# Altium project MC21R01.PrjPCB (part 2 of 3)

## Sheet MC21R01_Inverter_2.SchDoc: MC21R01 Top Level
size A3; Author: AMP; DrawnBy: AMP; Organization: Altium Limited; Address1: 3 Minna Close; Address2: Belrose; Address3: NSW 2085; Address4: Australia; DocumentNumber: 0; Revision: 1.0; SheetNumber: 0; SheetTotal: 0
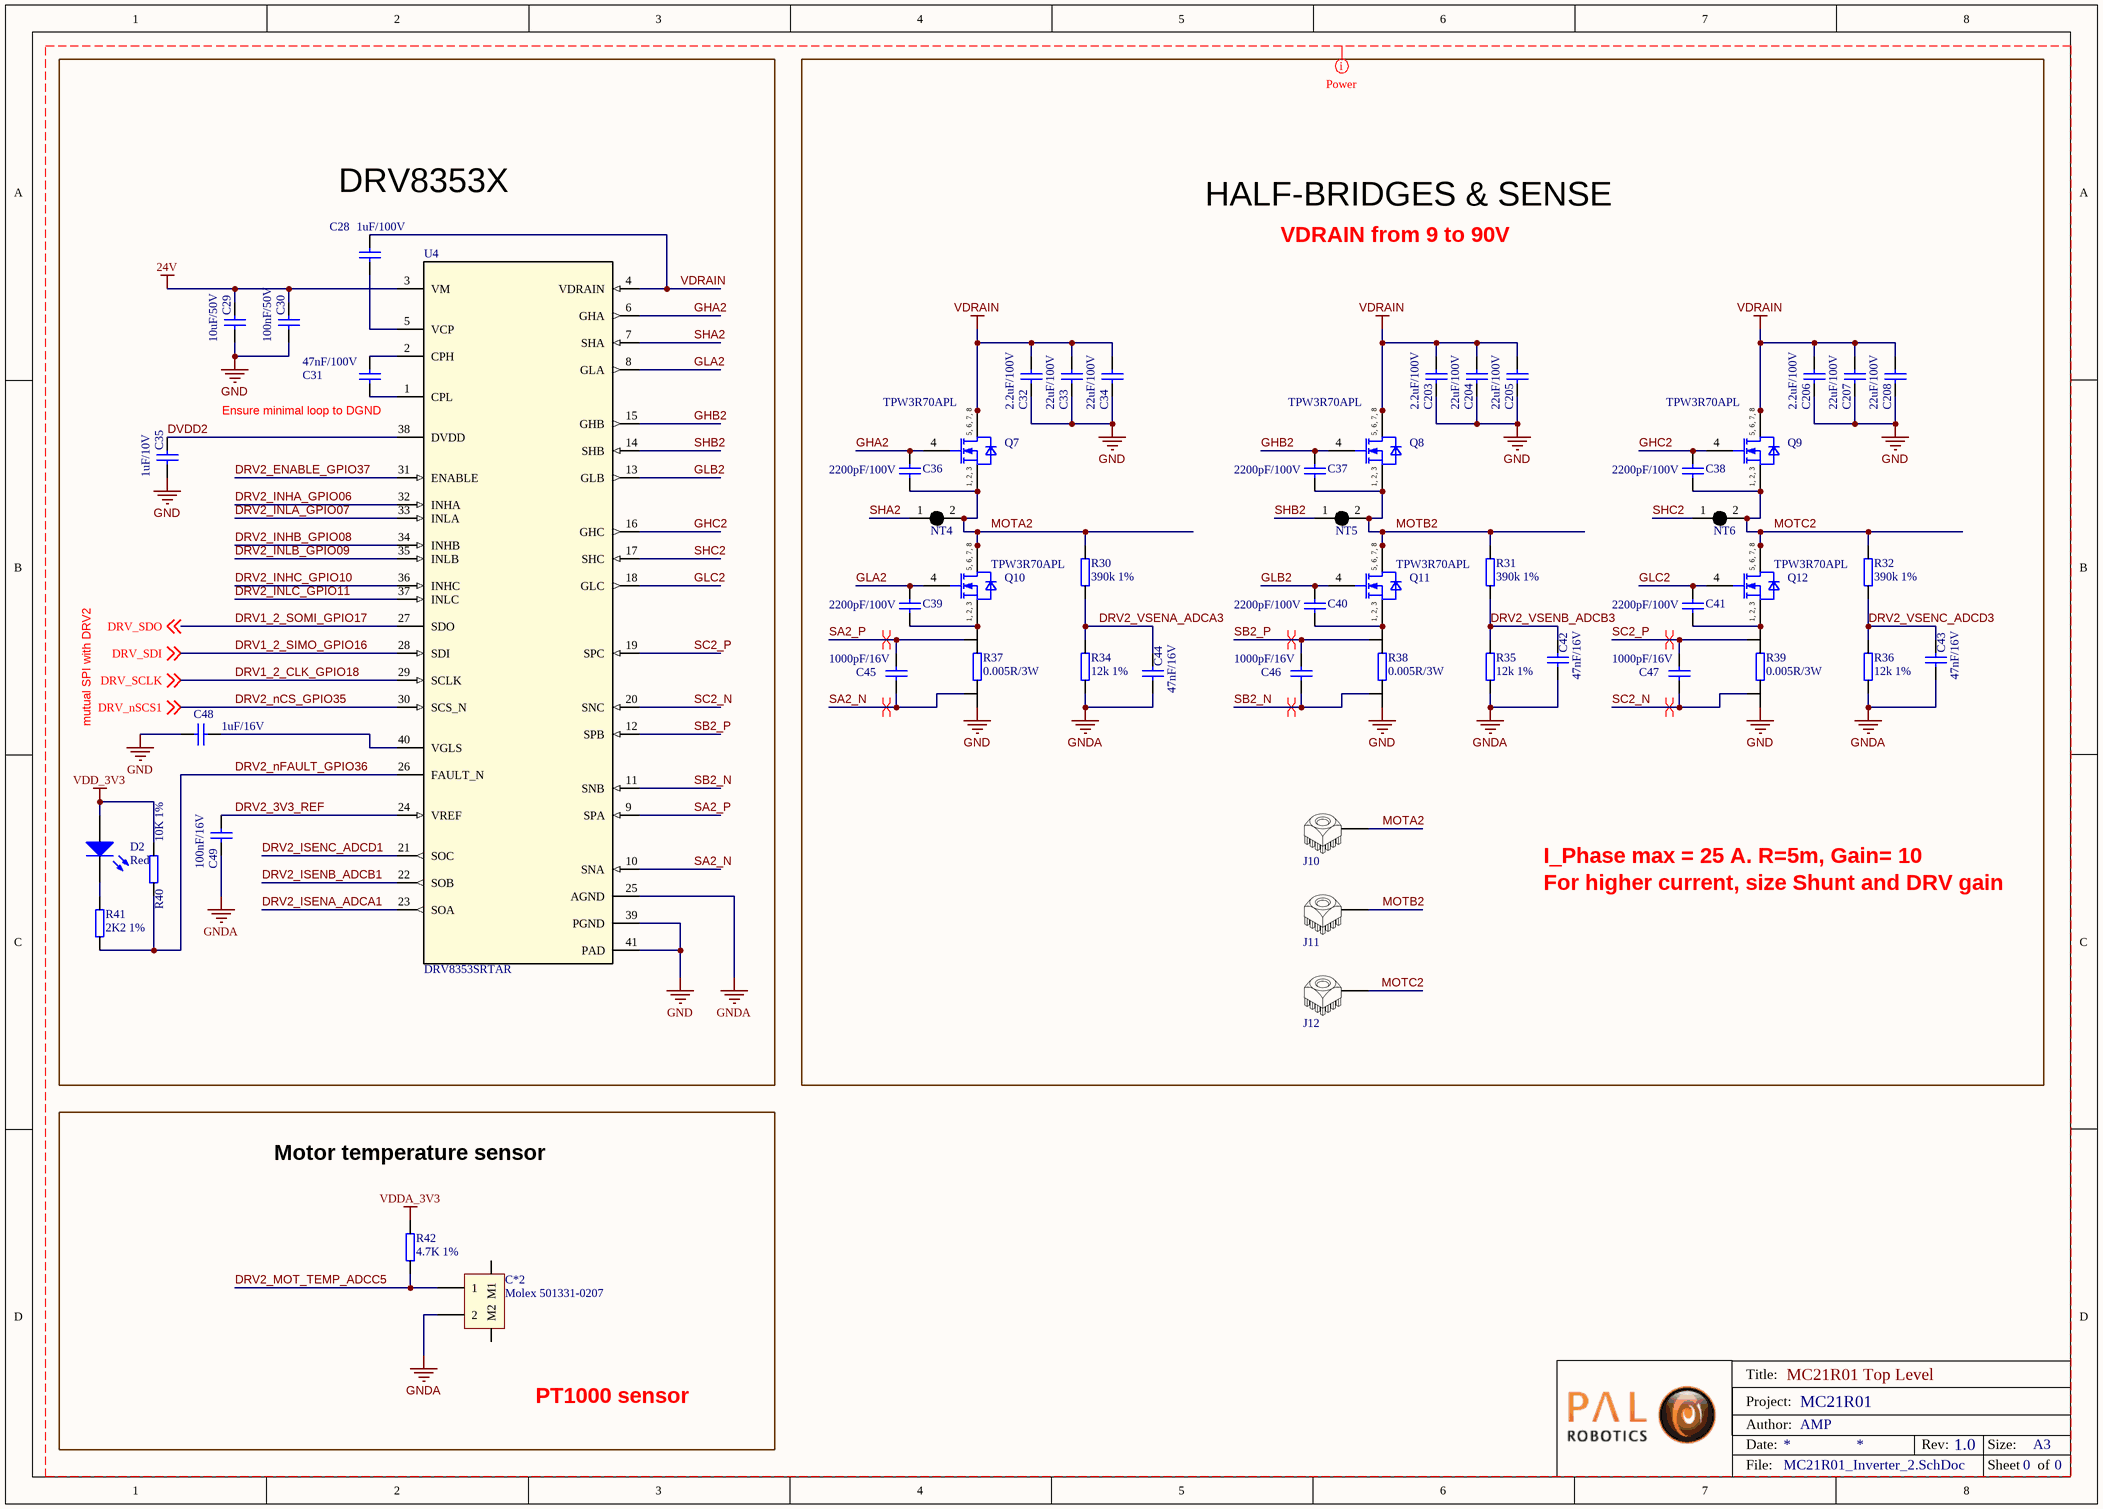
[diagram p6: MC21R01_Inverter_2.SchDoc]

### Parts
C28  value 1uF/100V  [0805 SMD capacitor]  (hidden comment: 1uF/100V 0805 10% X7R)
C29  value 10uF/50V  [1206 SMD Capacitor]  (hidden comment: 10uf/50V 1206 20% X5R)
C30  value 100nF/50V  [0603 SMD capacitor]  (hidden comment: 100nF/50V 0603 10% X7R)
C31  value 47nF/100V  [0603 SMD capacitor]  (hidden comment: 47nF/100V 0603 10% X7R)
C32  value 2.2uF/100V  [1210 SMD capacitor h=2mm]  (hidden comment: 2.2uF/100V 1210 10% X7R)
C33  value 22uF/100V  [2220 SMD Capacitor H=5MM]  (hidden comment: 22uF/100V 2220 20% X7S)
C34  value 22uF/100V  [2220 SMD Capacitor H=5MM]  (hidden comment: 22uF/100V 2220 20% X7S)
C35  value 1uF/10V  [0603 SMD capacitor]  (hidden comment: 1uF/10V 0603 10% X7R)
C36  value 2200pF/100V  [0402 SMD Capacitor]  (hidden comment: 2200pF/100V 0402 10% X7S)
C37  value 2200pF/100V  [0402 SMD Capacitor]  (hidden comment: 2200pF/100V 0402 10% X7S)
C38  value 2200pF/100V  [0402 SMD Capacitor]  (hidden comment: 2200pF/100V 0402 10% X7S)
C39  value 2200pF/100V  [0402 SMD Capacitor]  (hidden comment: 2200pF/100V 0402 10% X7S)
C40  value 2200pF/100V  [0402 SMD Capacitor]  (hidden comment: 2200pF/100V 0402 10% X7S)
C41  value 2200pF/100V  [0402 SMD Capacitor]  (hidden comment: 2200pF/100V 0402 10% X7S)
C42  value 47nF/16V  [0402 SMD Capacitor]  (hidden comment: 47nF/16V 0402 10% X7R)
C43  value 47nF/16V  [0402 SMD Capacitor]  (hidden comment: 47nF/16V 0402 10% X7R)
C44  value 47nF/16V  [0402 SMD Capacitor]  (hidden comment: 47nF/16V 0402 10% X7R)
C45  value 1000pF/16V  [0402 SMD Capacitor]  (hidden comment: 1000pF/16V 0402 10% X7R)
C46  value 1000pF/16V  [0402 SMD Capacitor]  (hidden comment: 1000pF/16V 0402 10% X7R)
C47  value 1000pF/16V  [0402 SMD Capacitor]  (hidden comment: 1000pF/16V 0402 10% X7R)
C48  value 1uF/16V  [0603 SMD capacitor]  (hidden comment: 1uF/16V 0603 10% X7R)
C49  value 100nF/16V  [0402 SMD Capacitor]  (hidden comment: 100nF/16V 0402 10% X7R)
C203  value 2.2uF/100V  [1210 SMD capacitor h=2mm]  (hidden comment: 2.2uF/100V 1210 10% X7R)
C204  value 22uF/100V  [2220 SMD Capacitor H=5MM]  (hidden comment: 22uF/100V 2220 20% X7S)
C205  value 22uF/100V  [2220 SMD Capacitor H=5MM]  (hidden comment: 22uF/100V 2220 20% X7S)
C206  value 2.2uF/100V  [1210 SMD capacitor h=2mm]  (hidden comment: 2.2uF/100V 1210 10% X7R)
C207  value 22uF/100V  [2220 SMD Capacitor H=5MM]  (hidden comment: 22uF/100V 2220 20% X7S)
C208  value 22uF/100V  [2220 SMD Capacitor H=5MM]  (hidden comment: 22uF/100V 2220 20% X7S)
C*2  Molex 501331-0207  [Molex 501331-0207]
D2  Red  [0402 SMD LED Red]
J10  WE_7461094  [WE_7461094]  (value not drawn)
J11  WE_7461094  [WE_7461094]  (value not drawn)
J12  WE_7461094  [WE_7461094]  (value not drawn)
NT4  Net Tie SMD  [Net Tie SMD 0.4x0.8mm]  (value not drawn)  (net tie, no BOM)
NT5  Net Tie SMD  [Net Tie SMD 0.4x0.8mm]  (value not drawn)  (net tie, no BOM)
NT6  Net Tie SMD  [Net Tie SMD 0.4x0.8mm]  (value not drawn)  (net tie, no BOM)
Q7  TPW3R70APL  [DSOP Advance Toshiba]
Q8  TPW3R70APL  [DSOP Advance Toshiba]
Q9  TPW3R70APL  [DSOP Advance Toshiba]
Q10  TPW3R70APL  [DSOP Advance Toshiba]
Q11  TPW3R70APL  [DSOP Advance Toshiba]
Q12  TPW3R70APL  [DSOP Advance Toshiba]
R30  390k 1%  [0603 SMD resistor]
R31  390k 1%  [0603 SMD resistor]
R32  390k 1%  [0603 SMD resistor]
R34  12k 1%  [0603 SMD resistor]
R35  12k 1%  [0603 SMD resistor]
R36  12k 1%  [0603 SMD resistor]
R37  0.005R/3W  [2512 SMD Resistor V2 NETTIE]
R38  0.005R/3W  [2512 SMD Resistor V2 NETTIE]
R39  0.005R/3W  [2512 SMD Resistor V2 NETTIE]
R40  10K 1%  [0402 SMD rESISTOR]
R41  2K2 1%  [0402 SMD rESISTOR]
R42  4.7K 1%  [0402 SMD rESISTOR]
U4  DRV8353SRTAR  [QFN50P600X600X80_HS-41N]

### Blocks framed on the sheet
DRV8353X: C28-C31 C35 C48 C49 D2 R40 R41 U4
HALF-BRIDGES & SENSE: C32-C34 C36-C47 C203-C208 J10-J12 NT4-NT6 Q7-Q12 R30-R32 R34-R39

### Nets
24V: C29.1 C30.1 U4.3(VM)
GND: C29.2 C30.2 C32.2 C33.2 C34.2 C35.2 C48.1 C203.2 C204.2 C205.2 C206.2 C207.2 C208.2 R37.1 R38.1 R39.1 U4.39(PGND) U4.41(PAD)
GNDA: C42.2 C43.2 C44.2 C49.2 C*2.2 R34.1 R35.1 R36.1 U4.25(AGND)
VDD_3V3: D2.A R40.2
VDDA_3V3: R42.2
VDRAIN: C28.1 C32.1 C33.1 C34.1 C203.1 C204.1 C205.1 C206.1 C207.1 C208.1 Q7.5(DRAIN) Q7.6(DRAIN) Q7.7(DRAIN) Q7.8(DRAIN) Q8.5(DRAIN) Q8.6(DRAIN) Q8.7(DRAIN) Q8.8(DRAIN) Q9.5(DRAIN) Q9.6(DRAIN) Q9.7(DRAIN) Q9.8(DRAIN) U4.4(VDRAIN)
DRV1_2_CLK_GPIO18: U4.29(SCLK) ; off-sheet DRV_SCLK  [also labelled DRV_SCLK]
DRV1_2_SIMO_GPIO16: U4.28(SDI) ; off-sheet DRV_SDI  [also labelled DRV_SDI]
DRV1_2_SOMI_GPIO17: U4.27(SDO) ; off-sheet DRV_SDO  [also labelled DRV_SDO]
DRV2_3V3_REF: C49.1 U4.24(VREF)
DRV2_ENABLE_GPIO37: U4.31(ENABLE)
DRV2_INHA_GPIO06: U4.32(INHA)
DRV2_INHB_GPIO08: U4.34(INHB)
DRV2_INHC_GPIO10: U4.36(INHC)
DRV2_INLA_GPIO07: U4.33(INLA)
DRV2_INLB_GPIO09: U4.35(INLB)
DRV2_INLC_GPIO11: U4.37(INLC)
DRV2_ISENA_ADCA1: U4.23(SOA)
DRV2_ISENB_ADCB1: U4.22(SOB)
DRV2_ISENC_ADCD1: U4.21(SOC)
DRV2_MOT_TEMP_ADCC5: C*2.1 R42.1
DRV2_nCS_GPIO35: U4.30(SCS_N) ; off-sheet DRV_nSCS1  [also labelled DRV_nSCS1]
DRV2_nFAULT_GPIO36: R40.1 R41.1 U4.26(FAULT_N)
DRV2_VSENA_ADCA3: C44.1 R30.1 R34.2
DRV2_VSENB_ADCB3: C42.1 R31.1 R35.2
DRV2_VSENC_ADCD3: C43.1 R32.1 R36.2
DVDD2: C35.1 U4.38(DVDD)
GHA2: C36.1 Q7.4(GATE) U4.6(GHA)
GHB2: C37.1 Q8.4(GATE) U4.15(GHB)
GHC2: C38.1 Q9.4(GATE) U4.16(GHC)
GLA2: C39.1 Q10.4(GATE) U4.8(GLA)
GLB2: C40.1 Q11.4(GATE) U4.13(GLB)
GLC2: C41.1 Q12.4(GATE) U4.18(GLC)
MOTA2: C36.2 J10.1 NT4.2 Q7.1(SOURCE) Q7.2(SOURCE) Q7.3(SOURCE) Q10.5(DRAIN) Q10.6(DRAIN) Q10.7(DRAIN) Q10.8(DRAIN) R30.2
MOTB2: C37.2 J11.1 NT5.2 Q8.1(SOURCE) Q8.2(SOURCE) Q8.3(SOURCE) Q11.5(DRAIN) Q11.6(DRAIN) Q11.7(DRAIN) Q11.8(DRAIN) R31.2
MOTC2: C38.2 J12.1 NT6.2 Q9.1(SOURCE) Q9.2(SOURCE) Q9.3(SOURCE) Q12.5(DRAIN) Q12.6(DRAIN) Q12.7(DRAIN) Q12.8(DRAIN) R32.2
SA2_N: C45.2 R37.3 U4.10(SNA)
SA2_P: C45.1 R37.4 U4.9(SPA)
SB2_N: C46.2 R38.3 U4.11(SNB)
SB2_P: C46.1 R38.4 U4.12(SPB)
SC2_N: C47.2 R39.3 U4.20(SNC)
SC2_P: C47.1 R39.4 U4.19(SPC)
SHA2: NT4.1 U4.7(SHA)
SHB2: NT5.1 U4.14(SHB)
SHC2: NT6.1 U4.17(SHC)
NetC28_2: C28.2 U4.5(VCP)
NetC31_1: C31.1 U4.2(CPH)
NetC31_2: C31.2 U4.1(CPL)
NetC39_2: C39.2 Q10.1(SOURCE) Q10.2(SOURCE) Q10.3(SOURCE) R37.2
NetC40_2: C40.2 Q11.1(SOURCE) Q11.2(SOURCE) Q11.3(SOURCE) R38.2
NetC41_2: C41.2 Q12.1(SOURCE) Q12.2(SOURCE) Q12.3(SOURCE) R39.2
NetC48_2: C48.2 U4.40(VGLS)
NetD2_K: D2.K R41.2

Not connected (* = marked no-connect by the designer): C*2 M1 M2

### Layout directives
net class Power: 24V, DRV1_2_CLK_GPIO18, DRV1_2_SIMO_GPIO16, DRV1_2_SOMI_GPIO17, DRV2_3V3_REF, DRV2_ENABLE_GPIO37, DRV2_INHA_GPIO06, DRV2_INHB_GPIO08, DRV2_INHC_GPIO10, DRV2_INLA_GPIO07, DRV2_INLB_GPIO09, DRV2_INLC_GPIO11, DRV2_ISENA_ADCA1, DRV2_ISENB_ADCB1, DRV2_ISENC_ADCD1, DRV2_MOT_TEMP_ADCC5, DRV2_nCS_GPIO35, DRV2_nFAULT_GPIO36, DRV2_VSENA_ADCA3, DRV2_VSENB_ADCB3, DRV2_VSENC_ADCD3, DRV_nSCS1, DRV_SCLK, DRV_SDI, DRV_SDO, DVDD2, GHA2, GHB2, GHC2, GLA2, GLB2, GLC2, GND, GNDA, MOTA2, MOTB2, MOTC2, SA2_N, SA2_P, SB2_N, SB2_P, SC2_N, SC2_P, SHA2, SHB2, SHC2, VDD_3V3, VDDA_3V3, VDRAIN
differential pair; differential pair class ADC: SA2_N, SA2_P, SB2_N, SB2_P, SC2_N, SC2_P

### Notes on the sheet
- VDRAIN from 9 to 90V
- (near C31) Ensure minimal loop to DGND
- mutual SPI with DRV2
- I_Phase max = 25 A. R=5m, Gain= 10
- For higher current, size Shunt and DRV gain
- Motor temperature sensor
- PT1000 sensor
- Title:
- Date:
- Project:
- Author:
- Rev:
- Size:
- A3
- File:
- Sheet
- of
- (in symbol TPW3R70APL) 5, 6, 7, 8; 1, 2, 3

### Library data of the parts
C28 = 1uF/100V 0805 10% X7R: 1 uF 100 V 0805  ±10% Tolerance X7R Multilayer Ceramic Chip Capacitor; Manufacturer 1: AVX; Manufacturer Part Number 1: 08051C105K4T2A; Supplier 1: Farnell; Supplier 2: Mouser; Supplier Part Number 1: 2834935; Supplier Part Number 2: 581-08051C105K4T2A
C29 = 10uF/50V 1206 20% X5R: 10 uF 50 V 1206 ±20% Tolerance X5R Multilayer Ceramic Chip Capacitor; Manufacturer 1: Samsung; Manufacturer Part Number 1: CL31A106MBHNNNE; Supplier 1: Digi-key; Supplier Part Number 1: 1276-6736-1-ND
C30 = 100nF/50V 0603 10% X7R: 100 nF 50 V 0603  ±10% Tolerance X7R Multilayer Ceramic Chip Capacitor; Manufacturer 1: Samsung; Manufacturer Part Number 1: CL10B104KB8NNNC; Supplier Part Number 1: 1276-1000-1-ND; Supplier 1: Digi-key
C31 = 47nF/100V 0603 10% X7R_1: 47 nF 100 V 0603 ±10% Tolerance X7R Multilayer Ceramic Chip Capacitor; Manufacturer 1: KEMET; Manufacturer Part Number 1: C0603C473K1RACTU; Supplier 1: Farnell; Supplier Part Number 1: 1865550
C32 C203 C206 = 2.2uF/100V 1210 10% X7R: 2.2 uF 100 V 1210  ±10% Tolerance X7R Multilayer Ceramic Chip Capacitor; Manufacturer 1: KEMET; Manufacturer Part Number 1: C1210C225K1RACTU; Supplier 1: Farnell; Supplier Part Number 1: 1793832
C33 C34 C204 C205 C207 C208 = 22uF/100V 2220 20% X7S: 22 uF 100 V 2220 ±20% Tolerance X7S Multilayer Ceramic Chip Capacitor; Manufacturer 1: TDK; Manufacturer Part Number 1: CKG57NX7S2A226M500JH; Supplier 1: Farnell; Supplier Part Number 1: 2210742
C35 = 1uF/10V 0603 10% X7R: 1uF/10V 0603 10% Tolerance X7R Multilayer Ceramic Chip Capacitor; Manufacturer 1: TAIYO YUDEN; Manufacturer Part Number 1: LMK107B7105KA-T; Supplier Part Number 1: 2112849; Supplier 1: Farnell
C36-C41 = 2200pF/100V 0402 10% X7S: as C13 on sheet MC21R01_Inverter_1; Supplier 1: Farnell; Supplier Part Number 1: 2906779
C42-C44 = 47nF/16V 0402 10% X7R: 47nF/16V 0402 10% Tolerance X7R Multilayer Ceramic Chip Capacitor; Manufacturer 1: Walsin; Manufacturer Part Number 1: 0402B473J160CT; Supplier 1: Farnell; Supplier Part Number 1: 2524710
C45-C47 = 1000pF/16V 0402 10% X7R_1: 1000pF/16V 0402 10% Tolerance X7R Multilayer Ceramic Chip Capacitor; Manufacturer 1: KEMET; Manufacturer Part Number 1: C0402C102K4RACTU; Supplier 1: Farnell; Supplier Part Number 1: 2522378
C48 = 1uF/16V 0603 10% X7R: 1uF/16V 0603 10% Tolerance X7R Multilayer Ceramic Chip Capacitor; Manufacturer 1: TAIYO YUDEN; Manufacturer Part Number 1: EMK107B7105KA-T; Supplier Part Number 1: 2112839; Supplier 1: Farnell
C49 = 100nF/16V 0402 10% X7R: as C1 on sheet MC21R01_uC_Support; Supplier Part Number 1: 3013350; Supplier 1: Farnell
C*2 = Molex 501331-0207: PicoClasp 02 pin vertical; Supplier 1: Farnell; Supplier Part Number 1: 1835976
D2 = LED_0402_Red: as D1 on sheet MC21R01_Inverter_1; Supplier 1: Farnell; Supplier Part Number 1: 2507545
J10-J12 = WE_7461094: REDCUBE PRESS-FIT with external thread and full plain pin-plate WPSHFU, 130A, M3 screw, 9pins; Manufacturer: WURTH ELEKTRONIK; Manufacturer Part Number: 7461094; Created by: Yaiza Montes; Published: 29/05/20; Value: WE_7461094; Supplier 1: Farnell; Supplier 2: Mouser; Supplier 3: Digi-Key; Supplier Part Number 1: 1821284; Supplier Part Number 2: 710-7461094; Supplier Part Number 3: 732-3212-ND
NT4-NT6 = Net Tie SMD: Net Tie starpoint
Q7-Q12 = TPW3R70APL: Silicon N-channel MOS (U-MOS-H); Manufacturer: Toshiba Semicon; Manufacturer Order Number: TPW3R70APL; PackageReference: DSOP Advance; Supplier 1: Mouser; Supplier 2: Mouser; Supplier Part Number 1: 757-TPW3R70APLL1Q; Supplier Part Number 2: 757-TPW3R70APLL1Q
R30-R32 = 390k/150V 1% 0603 250mW: 390k/150V 1% 0603 250mW SMD Resistor; Manufacturer 1: Panasonic; Manufacturer Part Number 1: ERJPA3F3903V; Supplier 1: Farnell; Supplier Part Number 1: 2335911
R34-R36 = 12k/150V 1% 0603 250mW: 12k/150V 1% 0603 250mW SMD Resistor; Manufacturer 1: Panasonic; Manufacturer Part Number 1: ERJPA3F1202V; Supplier 1: Farnell; Supplier Part Number 1: 2335844
R37-R39 = 0.005R/3W 1% 2512 Shunt: 0.005R/3W 1% 2512 shunt SMD Resistor; Manufacturer 1: Bourns; Manufacturer Part Number 1: CRE2512-FZ-R005E-3; Supplier 1: Farnell; Supplier Part Number 1: 2434014
R40 = 10K/50V 1% 0402 100mW: as R16 on sheet MC21R01_uC_Support; Supplier 1: Farnell; Supplier Part Number 1: 9239359; Value: 10K
R41 = 2K2/50V 1% 0402 100mW: as R1 on sheet MC21R01_uC_Support; Supplier 1: Farnell; Supplier Part Number 1: 9239278
R42 = 4.7K/50V 1% 0402 100mW: as R9 on sheet MC21R01_uC_Support; Supplier 1: Farnell; Supplier Part Number 1: 1469712; Value: 4.7K
U4 = DRV8353SRTAR: 102-V max 3-phase smart gate driver with current shunt amplifiers; Manufacturer: Texas Instruments; PartNumber: DRV8353SRTAR; RefDes: RefDes; TYPE: TYPE; Value: Value; Supplier 1: Arrow; Manufacturer Part Number: DRV8353SRTAR; RoHS: No; Stock 1: 2000; Pricing 1: 2000=3,20540, 4000=3,09430, 10000=3,08440, 50000=3,06460 (USD); Supplier Part Number 1: DRV8353SRTAR

## Sheet MC21R01_Onboard_temp_sensors.SchDoc: MC21R01 Top Level
size A3; Author: AMP; DrawnBy: AMP; Organization: Altium Limited; Address1: 3 Minna Close; Address2: Belrose; Address3: NSW 2085; Address4: Australia; DocumentNumber: 0; Revision: 1.0; SheetNumber: 0; SheetTotal: 0
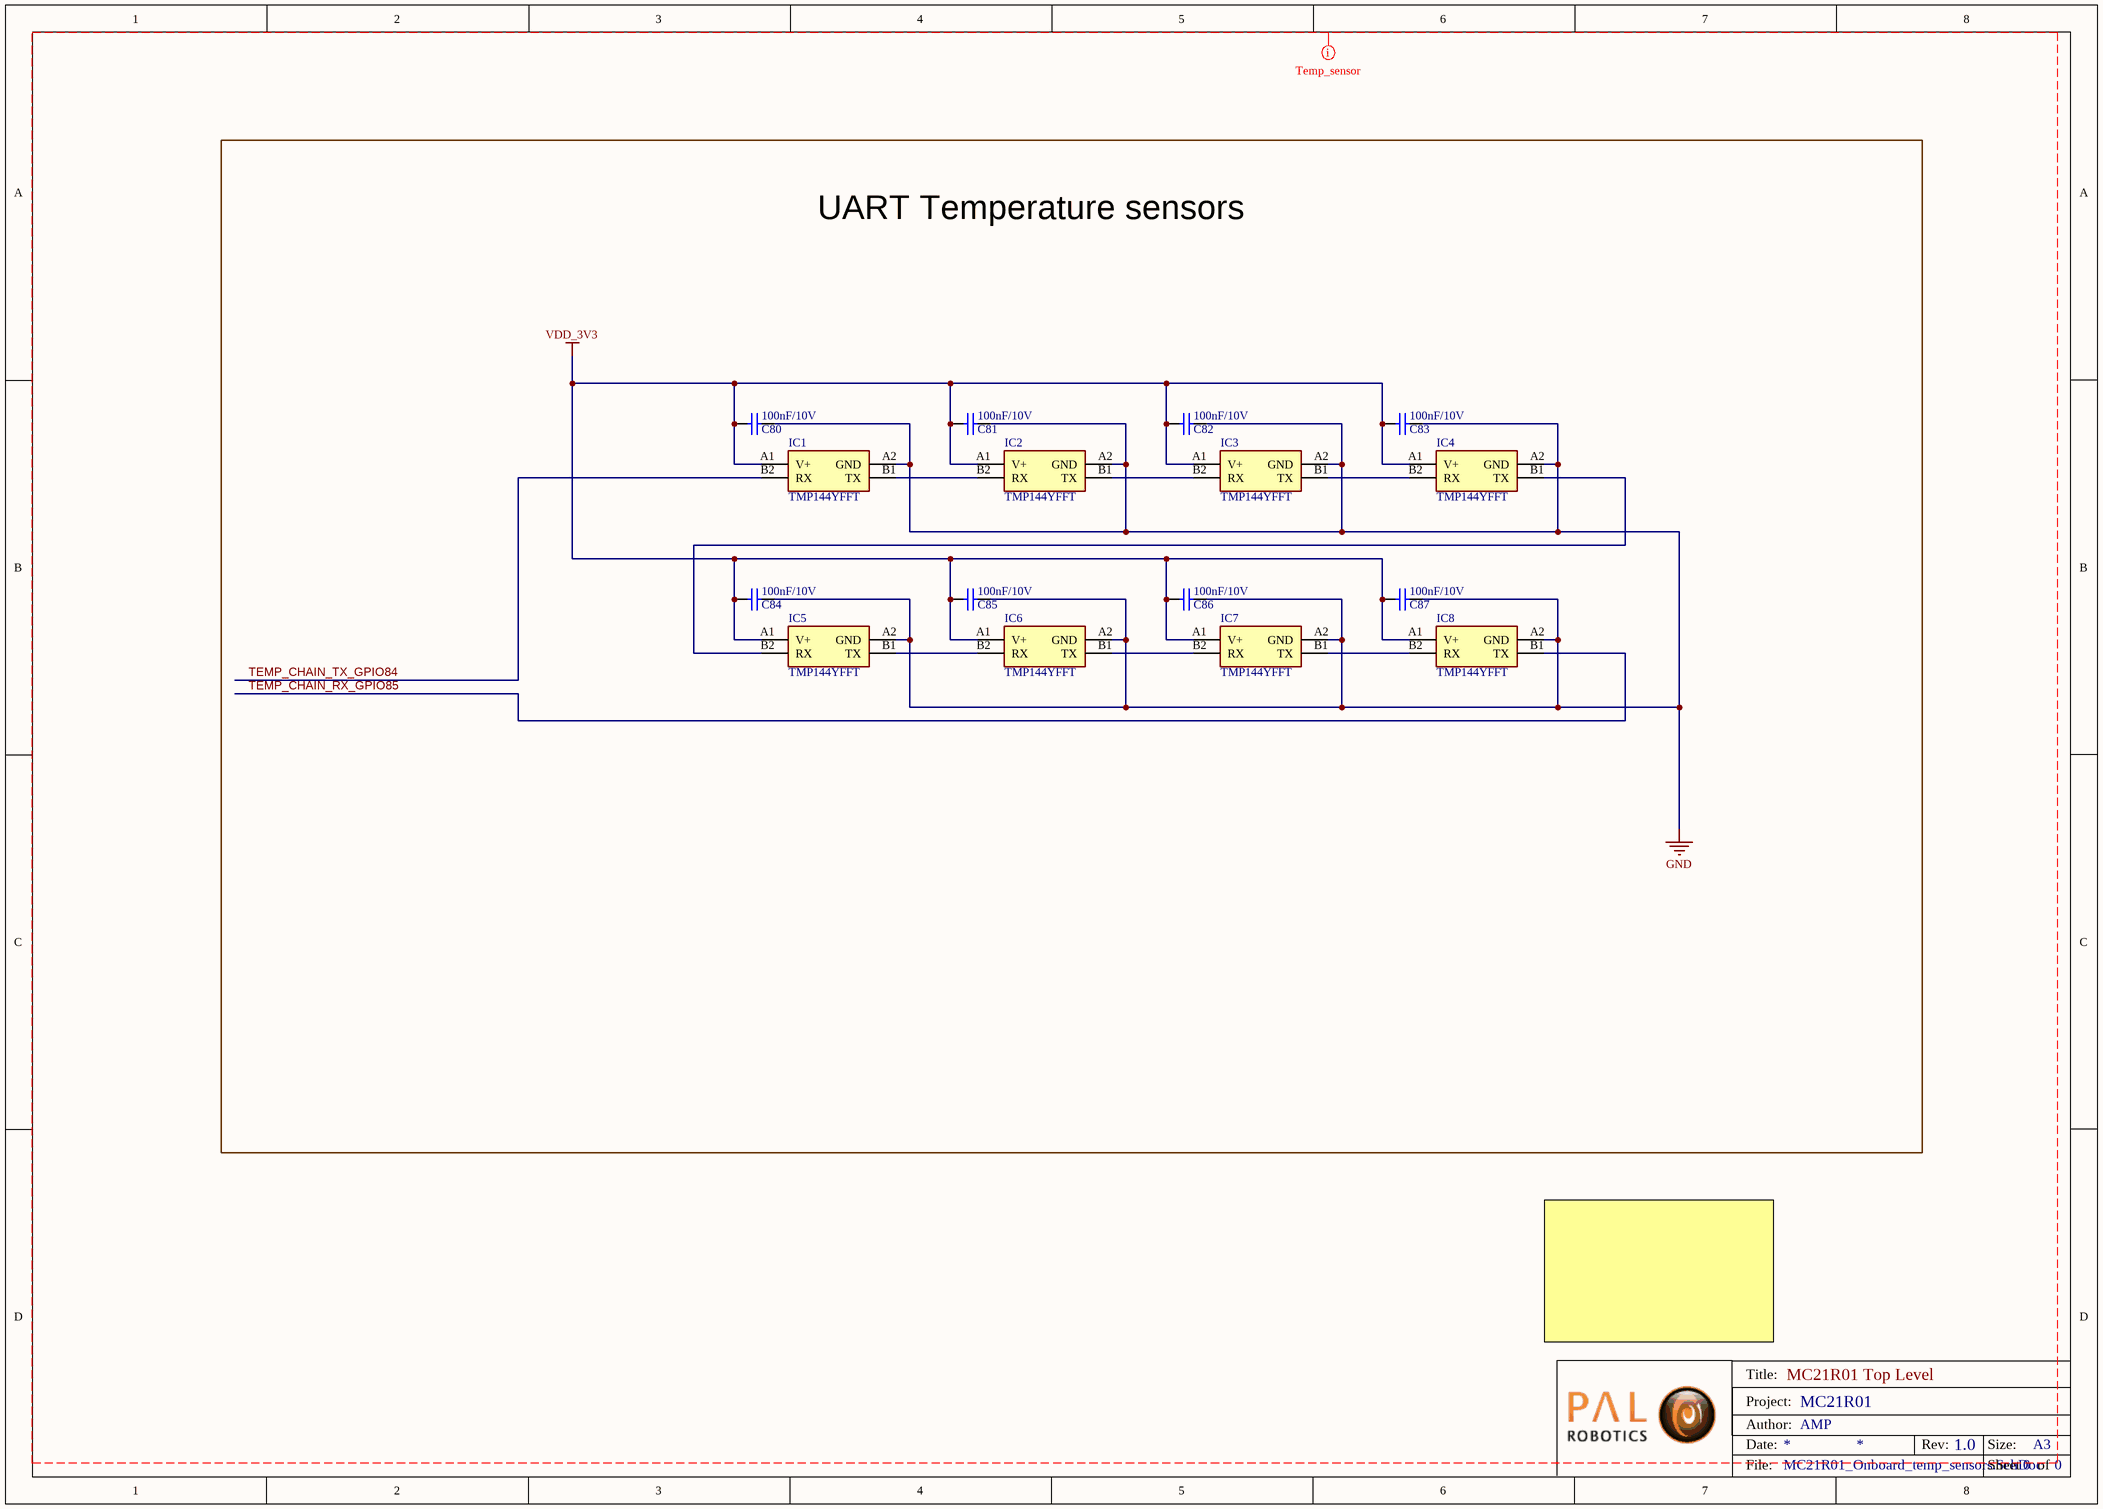
[diagram p7: MC21R01_Onboard_temp_sensors.SchDoc]

### Parts
C80  value 100nF/10V  [0402 SMD Capacitor]  (hidden comment: 100nF/10V 0402 20% X5R)
C81  value 100nF/10V  [0402 SMD Capacitor]  (hidden comment: 100nF/10V 0402 20% X5R)
C82  value 100nF/10V  [0402 SMD Capacitor]  (hidden comment: 100nF/10V 0402 20% X5R)
C83  value 100nF/10V  [0402 SMD Capacitor]  (hidden comment: 100nF/10V 0402 20% X5R)
C84  value 100nF/10V  [0402 SMD Capacitor]  (hidden comment: 100nF/10V 0402 20% X5R)
C85  value 100nF/10V  [0402 SMD Capacitor]  (hidden comment: 100nF/10V 0402 20% X5R)
C86  value 100nF/10V  [0402 SMD Capacitor]  (hidden comment: 100nF/10V 0402 20% X5R)
C87  value 100nF/10V  [0402 SMD Capacitor]  (hidden comment: 100nF/10V 0402 20% X5R)
IC1  TMP144YFFT  [TMP144YFFT]
IC2  TMP144YFFT  [TMP144YFFT]
IC3  TMP144YFFT  [TMP144YFFT]
IC4  TMP144YFFT  [TMP144YFFT]
IC5  TMP144YFFT  [TMP144YFFT]
IC6  TMP144YFFT  [TMP144YFFT]
IC7  TMP144YFFT  [TMP144YFFT]
IC8  TMP144YFFT  [TMP144YFFT]

### Blocks framed on the sheet
UART Temperature sensors: C80-C87 IC1-IC8

### Nets
GND: C80.2 C81.2 C82.2 C83.2 C84.2 C85.2 C86.2 C87.2 IC1.A2(GND) IC2.A2(GND) IC3.A2(GND) IC4.A2(GND) IC5.A2(GND) IC6.A2(GND) IC7.A2(GND) IC8.A2(GND)
VDD_3V3: C80.1 C81.1 C82.1 C83.1 C84.1 C85.1 C86.1 C87.1 IC1.A1(V+) IC2.A1(V+) IC3.A1(V+) IC4.A1(V+) IC5.A1(V+) IC6.A1(V+) IC7.A1(V+) IC8.A1(V+)
TEMP_CHAIN_RX_GPIO85: IC8.B1(TX)
TEMP_CHAIN_TX_GPIO84: IC1.B2(RX)
NetIC1_B1: IC1.B1(TX) IC2.B2(RX)
NetIC2_B1: IC2.B1(TX) IC3.B2(RX)
NetIC3_B1: IC3.B1(TX) IC4.B2(RX)
NetIC4_B1: IC4.B1(TX) IC5.B2(RX)
NetIC5_B1: IC5.B1(TX) IC6.B2(RX)
NetIC6_B1: IC6.B1(TX) IC7.B2(RX)
NetIC7_B1: IC7.B1(TX) IC8.B2(RX)

### Layout directives
net class Temp_sensor: GND, TEMP_CHAIN_RX_GPIO85, TEMP_CHAIN_TX_GPIO84, VDD_3V3

### Notes on the sheet
- Title:
- Date:
- Project:
- Author:
- Rev:
- Size:
- A3
- File:
- Sheet
- of

### Library data of the parts
C80-C87 = 100nF/10V 0402 20% X5R: 100nF/10V 0402 20% Tolerance X5R Multilayer Ceramic Chip Capacitor; Manufacturer 1: KEMET; Manufacturer Part Number 1: C0402C104M8PACTU; Supplier Part Number 1: 2810260; Supplier 1: Farnell
IC1-IC8 = TMP144YFFT: Integrated Circuit; Manufacturer_Name: Texas Instruments; Datasheet Link: http://www.ti.com/lit/ds/symlink/tmp144.pdf; Height: 0.625mm; Manufacturer_Part_Number: TMP144YFFT; Mouser Part Number: 595-TMP144YFFT; Mouser Price/Stock: https://www.mouser.com/Search/Refine.aspx?Keyword=595-TMP144YFFT

## Sheet MC21R01_uC_ADC.SchDoc: MC21R01 Top Level
size A3; Author: AMP; DrawnBy: AMP; Organization: Altium Limited; Address1: 3 Minna Close; Address2: Belrose; Address3: NSW 2085; Address4: Australia; DocumentNumber: 0; Revision: 1.0; SheetNumber: 0; SheetTotal: 0
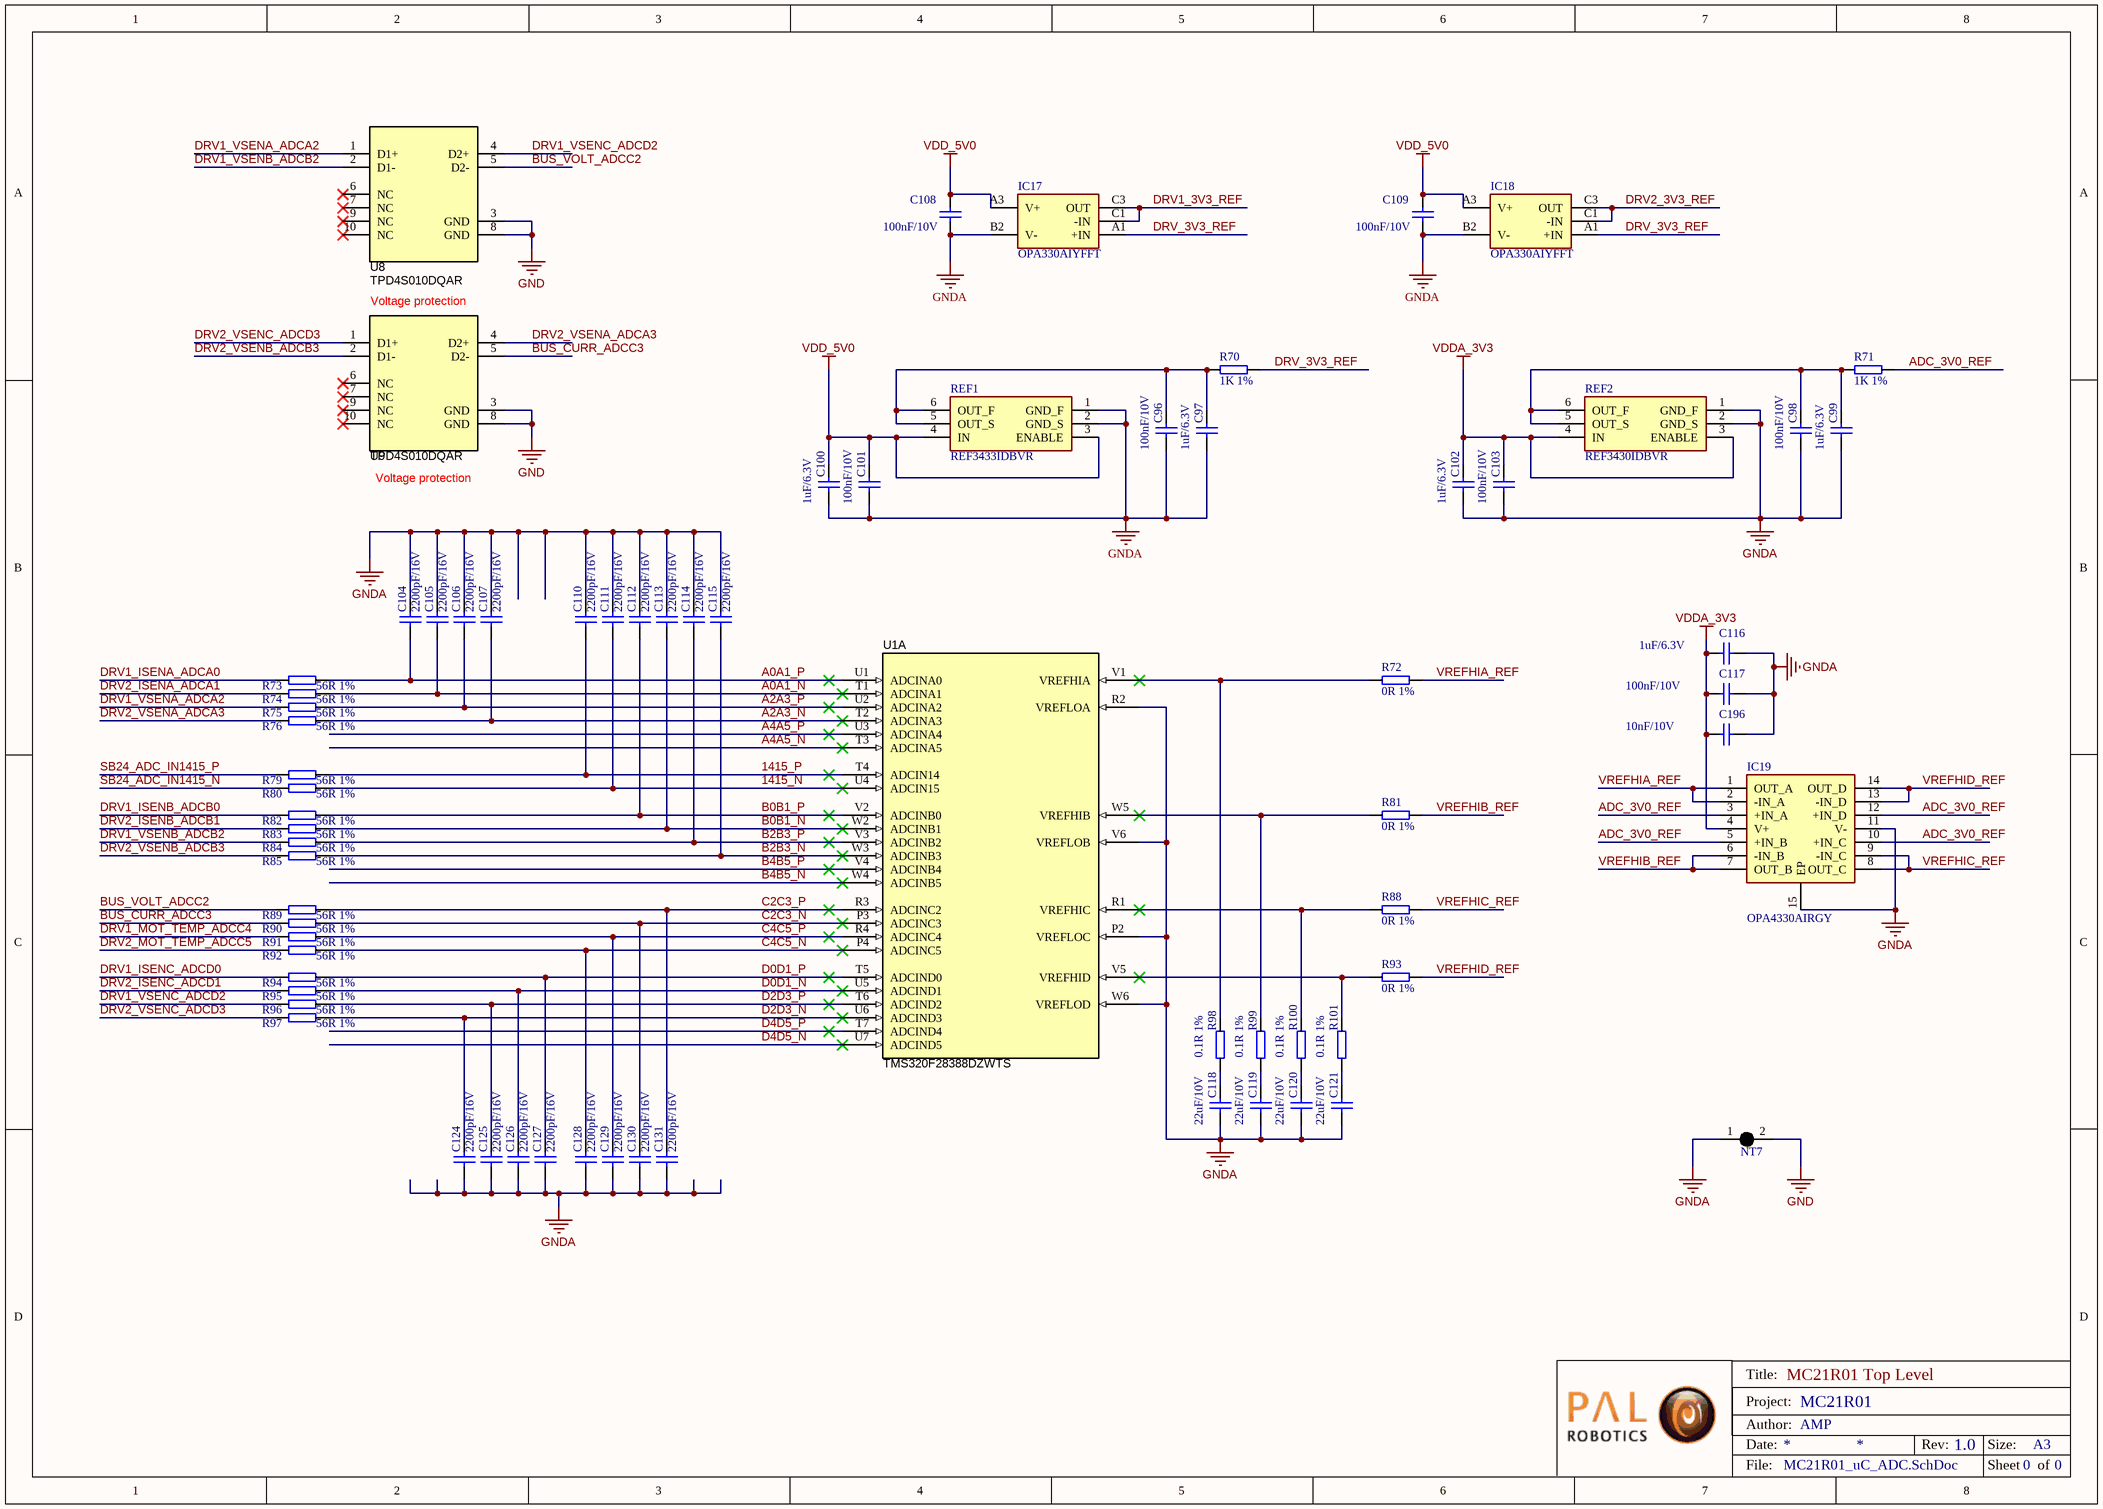
[diagram p8: MC21R01_uC_ADC.SchDoc]

### Parts
C96  value 100nF/10V  [0402 SMD Capacitor]  (hidden comment: 100nF/10V 0402 20% X5R)
C97  value 1uF/6.3V  [0402 SMD Capacitor]  (hidden comment: 1uF/6.3V 0402 10% X5R)
C98  value 100nF/10V  [0402 SMD Capacitor]  (hidden comment: 100nF/10V 0402 20% X5R)
C99  value 1uF/6.3V  [0402 SMD Capacitor]  (hidden comment: 1uF/6.3V 0402 10% X5R)
C100  value 1uF/6.3V  [0402 SMD Capacitor]  (hidden comment: 1uF/6.3V 0402 10% X5R)
C101  value 100nF/10V  [0402 SMD Capacitor]  (hidden comment: 100nF/10V 0402 20% X5R)
C102  value 1uF/6.3V  [0402 SMD Capacitor]  (hidden comment: 1uF/6.3V 0402 10% X5R)
C103  value 100nF/10V  [0402 SMD Capacitor]  (hidden comment: 100nF/10V 0402 20% X5R)
C104  value 2200pF/16V  [0402 SMD Capacitor]  (hidden comment: 2200pF/16V 0402 10% X7R)
C105  value 2200pF/16V  [0402 SMD Capacitor]  (hidden comment: 2200pF/16V 0402 10% X7R)
C106  value 2200pF/16V  [0402 SMD Capacitor]  (hidden comment: 2200pF/16V 0402 10% X7R)
C107  value 2200pF/16V  [0402 SMD Capacitor]  (hidden comment: 2200pF/16V 0402 10% X7R)
C108  value 100nF/10V  [0402 SMD Capacitor]  (hidden comment: 100nF/10V 0402 20% X5R)
C109  value 100nF/10V  [0402 SMD Capacitor]  (hidden comment: 100nF/10V 0402 20% X5R)
C110  value 2200pF/16V  [0402 SMD Capacitor]  (hidden comment: 2200pF/16V 0402 10% X7R)
C111  value 2200pF/16V  [0402 SMD Capacitor]  (hidden comment: 2200pF/16V 0402 10% X7R)
C112  value 2200pF/16V  [0402 SMD Capacitor]  (hidden comment: 2200pF/16V 0402 10% X7R)
C113  value 2200pF/16V  [0402 SMD Capacitor]  (hidden comment: 2200pF/16V 0402 10% X7R)
C114  value 2200pF/16V  [0402 SMD Capacitor]  (hidden comment: 2200pF/16V 0402 10% X7R)
C115  value 2200pF/16V  [0402 SMD Capacitor]  (hidden comment: 2200pF/16V 0402 10% X7R)
C116  value 1uF/6.3V  [0402 SMD Capacitor]  (hidden comment: 1uF/6.3V 0402 10% X5R)
C117  value 100nF/10V  [0402 SMD Capacitor]  (hidden comment: 100nF/10V 0402 20% X5R)
C118  value 22uF/10V  [0603 SMD capacitor]  (hidden comment: 22uF/10V 0603 20% X5R)
C119  value 22uF/10V  [0603 SMD capacitor]  (hidden comment: 22uF/10V 0603 20% X5R)
C120  value 22uF/10V  [0603 SMD capacitor]  (hidden comment: 22uF/10V 0603 20% X5R)
C121  value 22uF/10V  [0603 SMD capacitor]  (hidden comment: 22uF/10V 0603 20% X5R)
C124  value 2200pF/16V  [0402 SMD Capacitor]  (hidden comment: 2200pF/16V 0402 10% X7R)
C125  value 2200pF/16V  [0402 SMD Capacitor]  (hidden comment: 2200pF/16V 0402 10% X7R)
C126  value 2200pF/16V  [0402 SMD Capacitor]  (hidden comment: 2200pF/16V 0402 10% X7R)
C127  value 2200pF/16V  [0402 SMD Capacitor]  (hidden comment: 2200pF/16V 0402 10% X7R)
C128  value 2200pF/16V  [0402 SMD Capacitor]  (hidden comment: 2200pF/16V 0402 10% X7R)
C129  value 2200pF/16V  [0402 SMD Capacitor]  (hidden comment: 2200pF/16V 0402 10% X7R)
C130  value 2200pF/16V  [0402 SMD Capacitor]  (hidden comment: 2200pF/16V 0402 10% X7R)
C131  value 2200pF/16V  [0402 SMD Capacitor]  (hidden comment: 2200pF/16V 0402 10% X7R)
C196  value 10nF/10V  [0402 SMD Capacitor]  (hidden comment: 10nF/10V 0402 20% X5R)
IC17  OPA330AIYFFT  [OPA330 DSBGA]
IC18  OPA330AIYFFT  [OPA330 DSBGA]
IC19  OPA4330AIRGY  [OPA4330 RGY]
NT7  Net Tie SMD  [Net Tie SMD 0.4x0.8mm]  (value not drawn)  (net tie, no BOM)
R70  1K 1%  [0402 SMD rESISTOR]
R71  1K 1%  [0402 SMD rESISTOR]
R72  0R 1%  [0402 SMD rESISTOR]
R73  56R 1%  [0402 SMD rESISTOR]
R74  56R 1%  [0402 SMD rESISTOR]
R75  56R 1%  [0402 SMD rESISTOR]
R76  56R 1%  [0402 SMD rESISTOR]
R79  56R 1%  [0402 SMD rESISTOR]
R80  56R 1%  [0402 SMD rESISTOR]
R81  0R 1%  [0402 SMD rESISTOR]
R82  56R 1%  [0402 SMD rESISTOR]
R83  56R 1%  [0402 SMD rESISTOR]
R84  56R 1%  [0402 SMD rESISTOR]
R85  56R 1%  [0402 SMD rESISTOR]
R88  0R 1%  [0402 SMD rESISTOR]
R89  56R 1%  [0402 SMD rESISTOR]
R90  56R 1%  [0402 SMD rESISTOR]
R91  56R 1%  [0402 SMD rESISTOR]
R92  56R 1%  [0402 SMD rESISTOR]
R93  0R 1%  [0402 SMD rESISTOR]
R94  56R 1%  [0402 SMD rESISTOR]
R95  56R 1%  [0402 SMD rESISTOR]
R96  56R 1%  [0402 SMD rESISTOR]
R97  56R 1%  [0402 SMD rESISTOR]
R98  0.1R 1%  [0402 SMD rESISTOR]
R99  0.1R 1%  [0402 SMD rESISTOR]
R100  0.1R 1%  [0402 SMD rESISTOR]
R101  0.1R 1%  [0402 SMD rESISTOR]
REF1  REF3433IDBVR  [SOT95P280X145-6N]
REF2  REF3430IDBVR  [SOT95P280X145-6N]
U1  TMS320F28388DZWTS  [ZWT0337A]  (part A of 5)
U8  TPD4S010DQAR  [DQA0010A]
U9  TPD4S010DQAR  [DQA0010A]

### Nets
GND: NT7.2 U8.3(GND) U8.8(GND) U9.3(GND) U9.8(GND)
GNDA: C96.2 C97.2 C98.2 C99.2 C100.2 C101.2 C102.2 C103.2 C104.1 C105.1 C106.1 C107.1 C108.1 C109.1 C110.1 C111.1 C112.1 C113.1 C114.1 C115.1 C116.2 C117.2 C118.2 C119.2 C120.2 C121.2 C124.2 C125.2 C126.2 C127.2 C128.2 C129.2 C130.2 C131.2 C196.2 IC17.B2(V-) IC18.B2(V-) IC19.11(V-) IC19.15(EP) NT7.1 REF1.1(GND_F) REF1.2(GND_S) REF2.1(GND_F) REF2.2(GND_S) U1.P2(VREFLOC) U1.R2(VREFLOA) U1.V6(VREFLOB) U1.W6(VREFLOD)
VDD_5V0: C100.1 C101.1 C108.2 C109.2 IC17.A3(V+) IC18.A3(V+) REF1.3(ENABLE) REF1.4(IN)
VDDA_3V3: C102.1 C103.1 C116.1 C117.1 C196.1 IC19.4(V+) REF2.3(ENABLE) REF2.4(IN)
1415_N: C111.2 R80.1 U1.U4(ADCIN15)
1415_P: C110.2 R79.1 U1.T4(ADCIN14)
A0A1_N: C105.2 R74.1 U1.T1(ADCINA1)
A0A1_P: C104.2 R73.1 U1.U1(ADCINA0)
A2A3_N: C107.2 R76.1 U1.T2(ADCINA3)
A2A3_P: C106.2 R75.1 U1.U2(ADCINA2)
A4A5_N: U1.T3(ADCINA5)
A4A5_P: U1.U3(ADCINA4)
ADC_3V0_REF: IC19.3(+IN_A) IC19.5(+IN_B) IC19.10(+IN_C) IC19.12(+IN_D) R71.1
B0B1_N: C113.2 R83.1 U1.W2(ADCINB1)
B0B1_P: C112.2 R82.1 U1.V2(ADCINB0)
B2B3_N: C115.2 R85.1 U1.W3(ADCINB3)
B2B3_P: C114.2 R84.1 U1.V3(ADCINB2)
B4B5_N: U1.W4(ADCINB5)
B4B5_P: U1.V4(ADCINB4)
BUS_CURR_ADCC3: R90.2 U9.5(D2-)
BUS_VOLT_ADCC2: R89.2 U8.5(D2-)
C2C3_N: C130.1 R90.1 U1.P3(ADCINC3)
C2C3_P: C131.1 R89.1 U1.R3(ADCINC2)
C4C5_N: C128.1 R92.1 U1.P4(ADCINC5)
C4C5_P: C129.1 R91.1 U1.R4(ADCINC4)
D0D1_N: C126.1 R95.1 U1.U5(ADCIND1)
D0D1_P: C127.1 R94.1 U1.T5(ADCIND0)
D2D3_N: C124.1 R97.1 U1.U6(ADCIND3)
D2D3_P: C125.1 R96.1 U1.T6(ADCIND2)
D4D5_N: U1.U7(ADCIND5)
D4D5_P: U1.T7(ADCIND4)
DRV1_3V3_REF: IC17.C1(-IN) IC17.C3(OUT)
DRV1_ISENA_ADCA0: R73.2
DRV1_ISENB_ADCB0: R82.2
DRV1_ISENC_ADCD0: R94.2
DRV1_MOT_TEMP_ADCC4: R91.2
DRV1_VSENA_ADCA2: R75.2 U8.1(D1+)
DRV1_VSENB_ADCB2: R84.2 U8.2(D1-)
DRV1_VSENC_ADCD2: R96.2 U8.4(D2+)
DRV2_3V3_REF: IC18.C1(-IN) IC18.C3(OUT)
DRV2_ISENA_ADCA1: R74.2
DRV2_ISENB_ADCB1: R83.2
DRV2_ISENC_ADCD1: R95.2
DRV2_MOT_TEMP_ADCC5: R92.2
DRV2_VSENA_ADCA3: R76.2 U9.4(D2+)
DRV2_VSENB_ADCB3: R85.2 U9.2(D1-)
DRV2_VSENC_ADCD3: R97.2 U9.1(D1+)
DRV_3V3_REF: IC17.A1(+IN) IC18.A1(+IN) R70.1
SB24_ADC_IN1415_N: R80.2
SB24_ADC_IN1415_P: R79.2
VREFHIA_REF: IC19.1(OUT_A) IC19.2(-IN_A) R72.2
VREFHIB_REF: IC19.6(-IN_B) IC19.7(OUT_B) R81.2
VREFHIC_REF: IC19.8(OUT_C) IC19.9(-IN_C) R88.2
VREFHID_REF: IC19.13(-IN_D) IC19.14(OUT_D) R93.2
NetC96_1: C96.1 C97.1 R70.2 REF1.5(OUT_S) REF1.6(OUT_F)
NetC98_1: C98.1 C99.1 R71.2 REF2.5(OUT_S) REF2.6(OUT_F)
NetC118_1: C118.1 R98.1
NetC119_1: C119.1 R99.1
NetC120_1: C120.1 R100.1
NetC121_1: C121.1 R101.1
NetR72_1: R72.1 R98.2 U1.V1(VREFHIA)
NetR81_1: R81.1 R99.2 U1.W5(VREFHIB)
NetR88_1: R88.1 R100.2 U1.R1(VREFHIC)
NetR93_1: R93.1 R101.2 U1.V5(VREFHID)

Not connected (* = marked no-connect by the designer): U8 6(NC)* 7(NC)* 9(NC)* 10(NC)*; U9 6(NC)* 7(NC)* 9(NC)* 10(NC)*

### Notes on the sheet
- (near U9) Voltage protection
- Title:
- Date:
- Project:
- Author:
- Rev:
- Size:
- A3
- File:
- Sheet
- of

### Library data of the parts
C96 C98 C101 C103 C108 C109 C117 = 100nF/10V 0402 20% X5R: 100nF/10V 0402 20% Tolerance X5R Multilayer Ceramic Chip Capacitor; Manufacturer 1: KEMET; Manufacturer Part Number 1: C0402C104M8PACTU; Supplier Part Number 1: 2810260; Supplier 1: Farnell
C97 C99 C100 C102 C116 = 1uF/6.3V 0402 10% X5R: 1uF/6.3V 0402 10% Tolerance X5R Multilayer Ceramic Chip Capacitor; Manufacturer 1: KEMET; Manufacturer Part Number 1: C0402C105K9PACTU; Supplier Part Number 1: 1288253; Supplier 1: Farnell
C104-C107 C110-C115 C124-C131 = 2200pF/16V 0402 10% X7R_1: 2200pF/16V 0402 10% Tolerance X7R Multilayer Ceramic Chip Capacitor; Manufacturer 1: Walsin; Manufacturer Part Number 1: 0402B222K160CT; Supplier 1: Farnell; Supplier Part Number 1: 2524690
C118-C121 = 22uF/10V 0603 20% X5R: 22 uF 10 V 0603 ±20% Tolerance X5R Multilayer Ceramic Chip Capacitor; Manufacturer 1: Murata; Manufacturer Part Number 1: GRM188R60J106KE47D; Supplier 1: Farnell; Supplier Part Number 1: 2426957
C196 = 10nF/10V 0402 20% X5R: 10nF/10V 0402 20% Tolerance X5R Multilayer Ceramic Chip Capacitor; Manufacturer 1: KEMET; Manufacturer Part Number 1: C0402C103K8PACTU; Supplier Part Number 1: 2773069; Supplier 1: Farnell
IC17 IC18 = OPA330AIYFFT: 1 Channel op amp  0.25-μV/°C, 35-μA CMOS Operational Amplifiers Zero-Drift; Manufacturer_Name: Texas Instruments; Datasheet Link: http://www.ti.com/lit/gpn/opa330; Height: 1.45mm; Manufacturer_Part_Number: OPA330AIYFFT; Supplier Part Number 1: 595-OPA330AIYFFT; Mouser Price/Stock: https://www.mouser.co.uk/ProductDetail/Texas-Instruments/OPA330AIDBVT?qs=DS7Z8uEdLNxVoZWMB%2FsKAQ%3D%3D; RS Part Number: 8122619P; RS Price/Stock: http://uk.rs-online.com/web/p/products/8122619P; Supplier 1: Mouser
IC19 = OPA4330AIRGY: 4 Channel op amp  0.25-μV/°C, 35-μA CMOS Operational Amplifiers Zero-Drift; Manufacturer_Name: Texas Instruments; Manufacturer_Part_Number: OPA4330AIDR; Datasheet Link: http://www.ti.com/lit/gpn/opa4330; Height: 1.75mm; Supplier Part Number 1: 595-OPA4330AIRGYT; Mouser Price/Stock: https://www.mouser.co.uk/ProductDetail/Texas-Instruments/OPA4330AIDR?qs=EuM%2FBx4ov4R6DjwOW%252BMW9A%3D%3D; Supplier 1: Mouser
NT7 = Net Tie SMD: Net Tie starpoint
R70 R71 = 1K/50V 1% 0402 100mW: 1K/50V 1% 0402 100mW SMD Resistor; Manufacturer 1: Yageo; Manufacturer Part Number 1: RC0402FR-071KL; Supplier 1: Mouser; Supplier 2: Farnell; Supplier Part Number 2: 9239235; Supplier Part Number 1: 603-RC0402FR-071KL; Value: 1K
R72 R81 R88 R93 = 0R/50V 1% 0402 100mW: 0R/50V 1% 0402 100mW SMD Resistor; Manufacturer 1: Vishay; Manufacturer Part Number 1: CRCW04020000Z0ED; Supplier 1: Farnell; Supplier Part Number 1: 1469661; Value: 0R
R73-R76 R79 R80 R82-R85 R89-R92 R94-R97 = 56R/50V 1% 0402 100mW: 56R/50V 1% 0402 100mW SMD Resistor; Manufacturer 1: Vishay; Manufacturer Part Number 1: CRCW040256R0FKEDHP; Supplier 1: Farnell; Supplier Part Number 1: 1738833; Value: 56R
R98-R101 = 0.1R/50V 1% 0402 100mW: 0.1R/50V 1% 0402 100mW SMD Resistor; Manufacturer 1: Yageo; Manufacturer Part Number 1: RC0402FR-071KL; Supplier 1: Farnell; Supplier Part Number 1: 1284586; Value: 0.1R
REF1 = REF3433IDBVR: 3V3 Low-drift Low power Voltage reference 10ppm/ºC; Manufacturer_Name: Texas Instruments; Datasheet Link: http://www.ti.com/lit/gpn/ref3430; Height: 1.45mm; Manufacturer_Part_Number: REF3433IDBVR; Supplier Part Number 1: 595-REF3433IDBVR; Supplier 1: Mouser
REF2 = REF3430IDBVR: 3V Low-drift Low power Voltage reference 10ppm/ºC; Manufacturer_Name: Texas Instruments; Datasheet Link: http://www.ti.com/lit/gpn/ref3430; Height: 1.45mm; Manufacturer_Part_Number: REF3430IDBVR; Supplier Part Number 1: 595-REF3430IDBVR; Supplier 1: Mouser
U1 = TMS320F28388: TMS320F28388DZWTS, ZWT0337A (NFBGA-337); Manufacturer: Texas Instruments; SizeAreaWB_mm2: 324; SizeArea_mm2: 256; AEC Qualified: N; AEC Category: Q200; SizeZ_mm: 1.4; SizeY_mm: 16; CompType: IC; ComponentLink1Description: Datasheet Link; ComponentLink2Description: Product Folder; PackageReference: ZWT0337A; PackageDescription: NFBGA-337; ComponentLink2URL: http://www.ti.com/product/tms320f28388d; Alternate Manufacturer: Texas Instruments; ComponentLink3URL: http://www.ti.com/product/tms320f28388d/datasheet; ComponentLink1URL: http://www.ti.com/lit/ds/symlink/tms320f28388d.pdf; MountType: SMT; ComponentLink3Description: Online Datasheet; SizeX_mm: 16; PartNumber: TMS320F28388DZWTS
U8 U9 = TPD4S010DQAR: ESD Solution for High-Speed Differential Interface, 4 Channels, -40 to +85 degC,10-pin SON (DQA), Green (RoHS & no Sb/Br); Manufacturer: Texas Instruments; IO Leakage Current(nA): 10; IO Capacitance(Typ)(pF): 0.8; 1394 / Firewire: TRUE; Breakdown Voltage(Min)(V): 9; Differential Capacitance(pF): 0.05; IEC 61000-4-2 Contact(+/- kV): 8; ComponentLink1URL: http://www.ti.com/; PackageDescription: 10-Pin Plastic Small Outline No-Lead, 1 x 2.5 x 0.55 mm Body, 0.5 mm Pitch; ComponentLink2URL: http://www.ti.com/general/docs/lit/getliterature.tsp?genericPartNumber=TPD4S010&fileType=pdf; Serial ATA / eSATA: TRUE; ComponentLink3Description: URL Link1; Eco-Plan: Green (RoHS & no Sb/Br); ComponentLink2Description: Datasheet; ComponentLink3URL: SamplesURL:http://www.ti.com/product/tpd4s010#samples; PackageReference: DQA0010A; DatasheetVersion: SLVS817E; SubFamily: ESD Solution; PackageVersion: revB, Sep-2009; Mounting Technology: Surface Mount; ComponentLink1Description: Manufacturer URL; IEC 61000-4-2 Air-Gap(+/- kV): 9; PartNumber: TPD4S010DQAR

## Sheet MC21R01_EtherCAT.SchDoc: MC21R01 Top Level
size A3; Author: AMP; DrawnBy: AMP; Organization: Altium Limited; Address1: 3 Minna Close; Address2: Belrose; Address3: NSW 2085; Address4: Australia; DocumentNumber: 0; Revision: 1.0; SheetNumber: 0; SheetTotal: 0
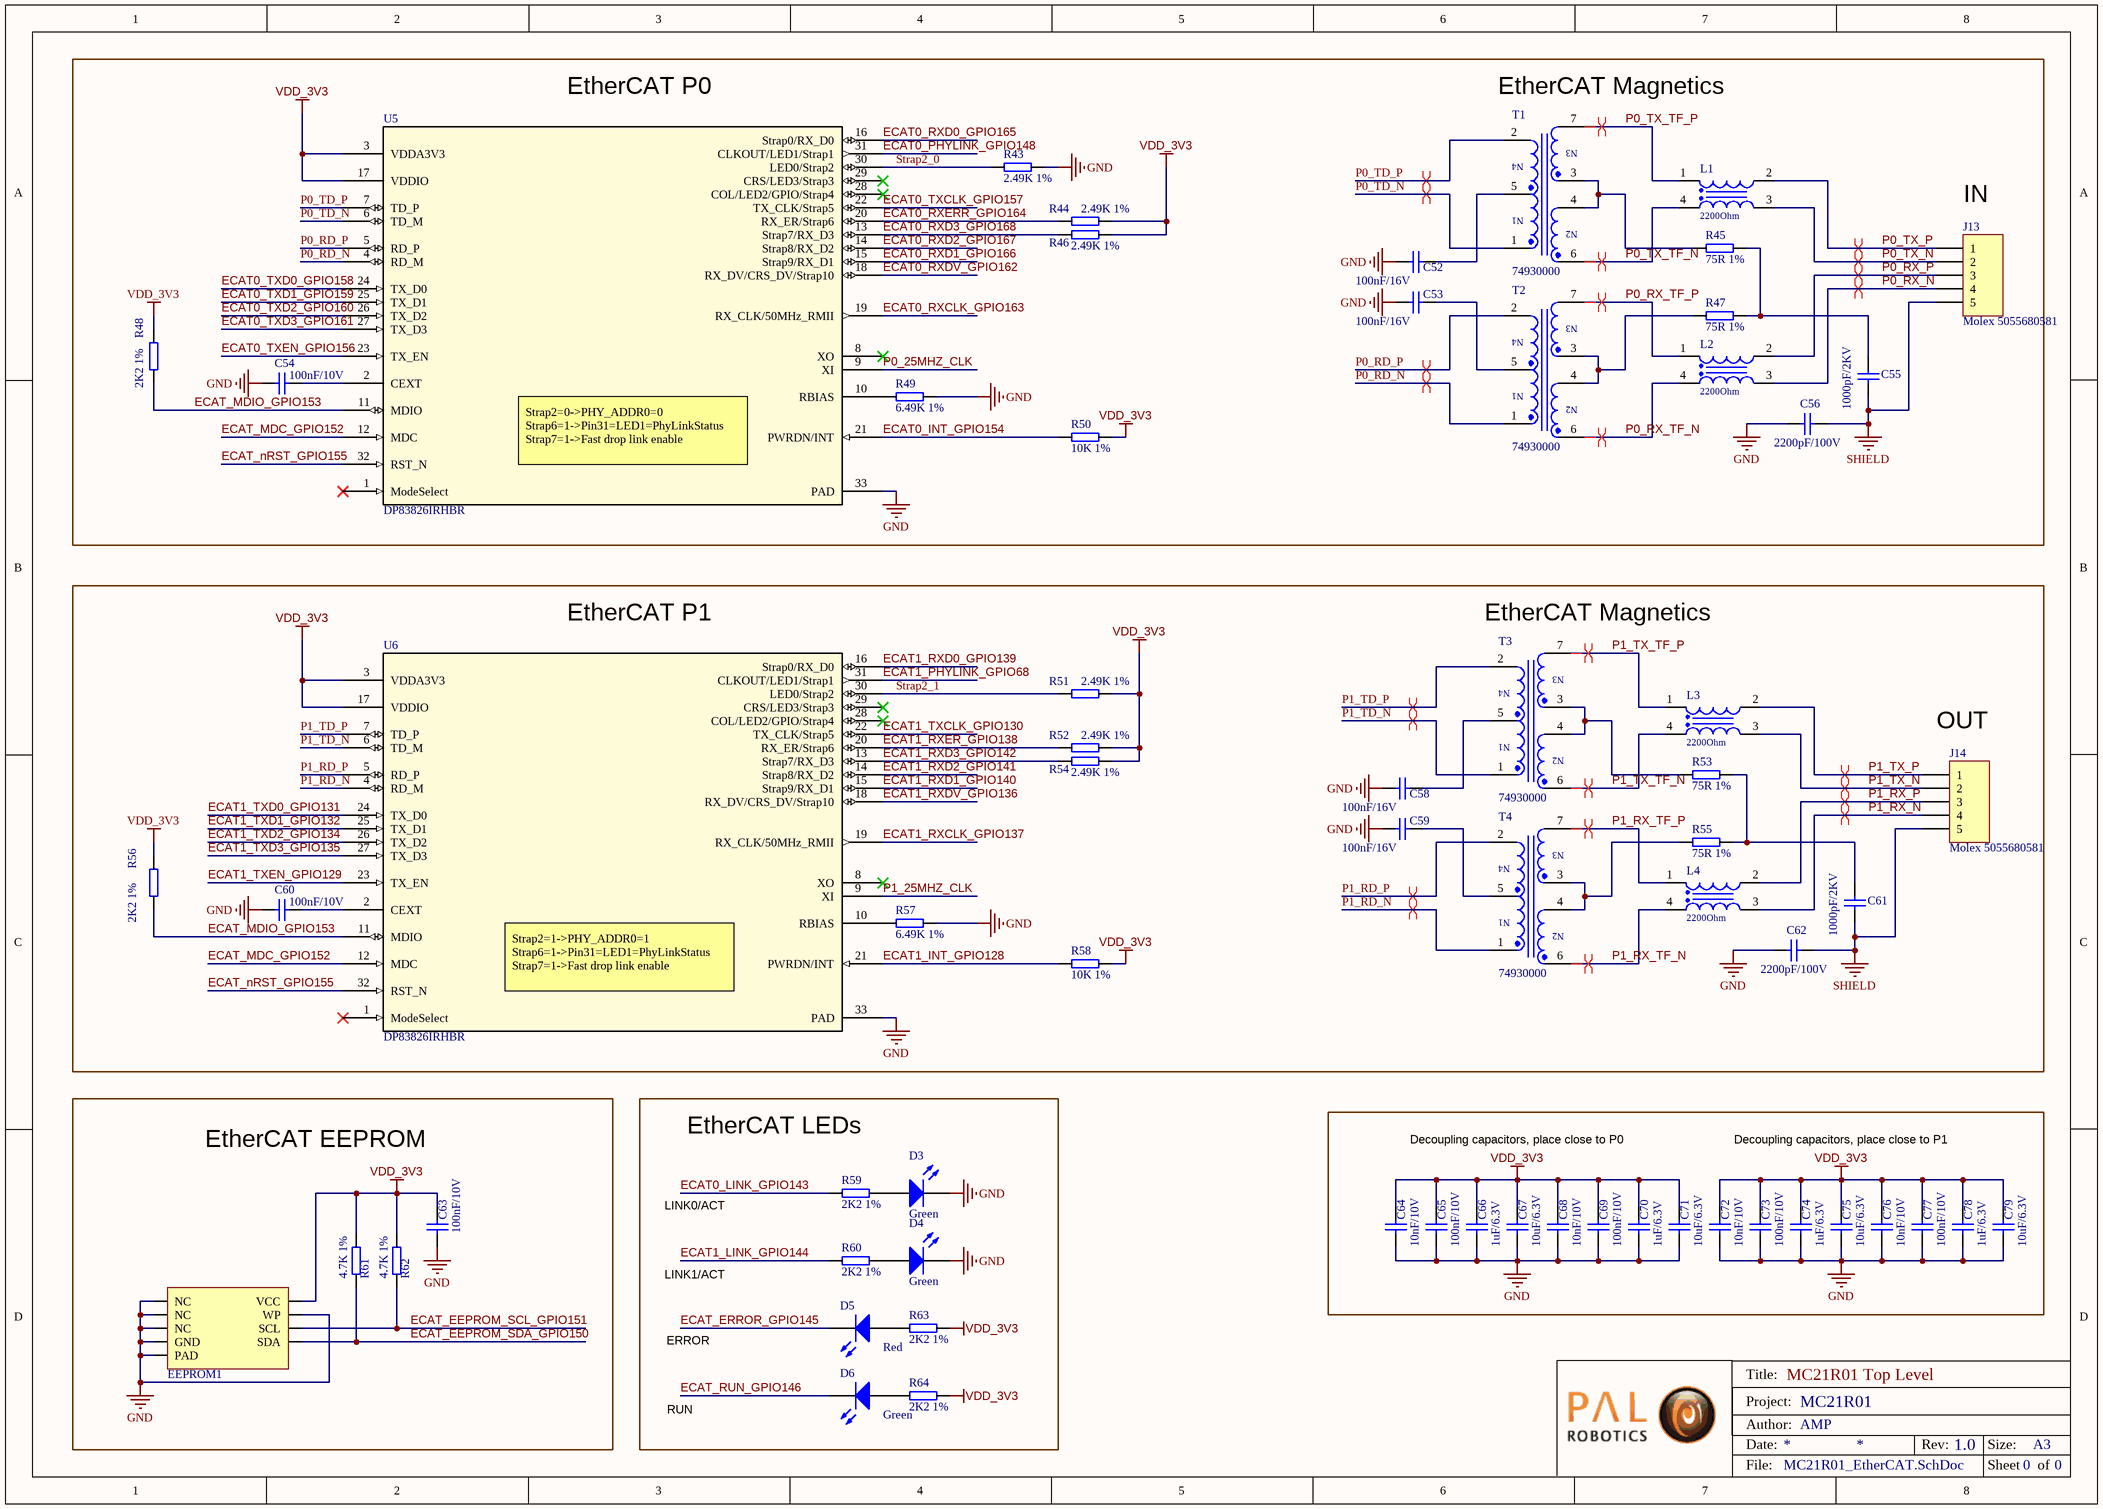
[diagram p9: MC21R01_EtherCAT.SchDoc]

### Parts
C52  value 100nF/16V  [0402 SMD Capacitor]  (hidden comment: 100nF/16V 0402 10% X7R)
C53  value 100nF/16V  [0402 SMD Capacitor]  (hidden comment: 100nF/16V 0402 10% X7R)
C54  value 100nF/10V  [0402 SMD Capacitor]  (hidden comment: 100nF/10V 0402 20% X5R)
C55  1000pF/2KV  [1206 SMD Capacitor]
C56  value 2200pF/100V  [0402 SMD Capacitor]  (hidden comment: 2200pF/100V 0402 10% X7S)
C58  value 100nF/16V  [0402 SMD Capacitor]  (hidden comment: 100nF/16V 0402 10% X7R)
C59  value 100nF/16V  [0402 SMD Capacitor]  (hidden comment: 100nF/16V 0402 10% X7R)
C60  value 100nF/10V  [0402 SMD Capacitor]  (hidden comment: 100nF/10V 0402 20% X5R)
C61  1000pF/2KV  [1206 SMD Capacitor]
C62  value 2200pF/100V  [0402 SMD Capacitor]  (hidden comment: 2200pF/100V 0402 10% X7S)
C63  value 100nF/10V  [0402 SMD Capacitor]  (hidden comment: 100nF/10V 0402 20% X5R)
C64  value 10nF/10V  [0402 SMD Capacitor]  (hidden comment: 10nF/10V 0402 20% X5R)
C65  value 100nF/10V  [0402 SMD Capacitor]  (hidden comment: 100nF/10V 0402 20% X5R)
C66  value 1uF/6.3V  [0402 SMD Capacitor]  (hidden comment: 1uF/6.3V 0402 10% X5R)
C67  value 10uF/6.3V  [0402 SMD Capacitor]  (hidden comment: 10uF/6.3V 0402 20% X5R)
C68  value 10nF/10V  [0402 SMD Capacitor]  (hidden comment: 10nF/10V 0402 20% X5R)
C69  value 100nF/10V  [0402 SMD Capacitor]  (hidden comment: 100nF/10V 0402 20% X5R)
C70  value 1uF/6.3V  [0402 SMD Capacitor]  (hidden comment: 1uF/6.3V 0402 10% X5R)
C71  value 10uF/6.3V  [0402 SMD Capacitor]  (hidden comment: 10uF/6.3V 0402 20% X5R)
C72  value 10nF/10V  [0402 SMD Capacitor]  (hidden comment: 10nF/10V 0402 20% X5R)
C73  value 100nF/10V  [0402 SMD Capacitor]  (hidden comment: 100nF/10V 0402 20% X5R)
C74  value 1uF/6.3V  [0402 SMD Capacitor]  (hidden comment: 1uF/6.3V 0402 10% X5R)
C75  value 10uF/6.3V  [0402 SMD Capacitor]  (hidden comment: 10uF/6.3V 0402 20% X5R)
C76  value 10nF/10V  [0402 SMD Capacitor]  (hidden comment: 10nF/10V 0402 20% X5R)
C77  value 100nF/10V  [0402 SMD Capacitor]  (hidden comment: 100nF/10V 0402 20% X5R)
C78  value 1uF/6.3V  [0402 SMD Capacitor]  (hidden comment: 1uF/6.3V 0402 10% X5R)
C79  value 10uF/6.3V  [0402 SMD Capacitor]  (hidden comment: 10uF/6.3V 0402 20% X5R)
D3  Green  [0402 SMD LED GREEN]
D4  Green  [0402 SMD LED GREEN]
D5  Red  [0402 SMD LED Red]
D6  Green  [0402 SMD LED GREEN]
EEPROM1  CAT24C16HU4I-GT3  [PQFN50P300X200X50_HS-9N]  (value not drawn)
J13  Molex 5055680581  [Molex 5055680581]
J14  Molex 5055680581  [Molex 5055680581]
L1  2200Ohm  [744232222]
L2  2200Ohm  [744232222]
L3  2200Ohm  [744232222]
L4  2200Ohm  [744232222]
R43  2.49K 1%  [0402 SMD rESISTOR]
R44  2.49K 1%  [0402 SMD rESISTOR]
R45  75R 1%  [0402 SMD rESISTOR]
R46  2.49K 1%  [0402 SMD rESISTOR]
R47  75R 1%  [0402 SMD rESISTOR]
R48  2K2 1%  [0402 SMD rESISTOR]
R49  6.49K 1%  [0402 SMD rESISTOR]
R50  10K 1%  [0402 SMD rESISTOR]
R51  2.49K 1%  [0402 SMD rESISTOR]
R52  2.49K 1%  [0402 SMD rESISTOR]
R53  75R 1%  [0402 SMD rESISTOR]
R54  2.49K 1%  [0402 SMD rESISTOR]
R55  75R 1%  [0402 SMD rESISTOR]
R56  2K2 1%  [0402 SMD rESISTOR]
R57  6.49K 1%  [0402 SMD rESISTOR]
R58  10K 1%  [0402 SMD rESISTOR]
R59  2K2 1%  [0402 SMD rESISTOR]
R60  2K2 1%  [0402 SMD rESISTOR]
R61  4.7K 1%  [0402 SMD rESISTOR]
R62  4.7K 1%  [0402 SMD rESISTOR]
R63  2K2 1%  [0402 SMD rESISTOR]
R64  2K2 1%  [0402 SMD rESISTOR]
T1  74930000  [74930000]
T2  74930000  [74930000]
T3  74930000  [74930000]
T4  74930000  [74930000]
U5  DP83826IRHBR  [RHB0032B]
U6  DP83826IRHBR  [RHB0032B]

### Blocks framed on the sheet
EtherCAT EEPROM: C63 EEPROM1 R61 R62
EtherCAT LEDs: D3-D6 R59 R60 R63 R64

### Nets
GND: C52.1 C53.1 C54.2 C56.1 C58.1 C59.1 C60.2 C62.1 C63.2 C64.2 C65.2 C66.2 C67.2 C68.2 C69.2 C70.2 C71.2 C72.2 C73.2 C74.2 C75.2 C76.2 C77.2 C78.2 C79.2 D3.K D4.K EEPROM1.1(NC) EEPROM1.2(NC) EEPROM1.3(NC) EEPROM1.4(GND) EEPROM1.7(WP) EEPROM1.9(PAD) R43.1 R49.2 R57.2 U5.33(PAD) U6.33(PAD)
SHIELD: C55.2 C56.2 C61.2 C62.2 J13.5 J14.5
VDD_3V3: C63.1 C64.1 C65.1 C66.1 C67.1 C68.1 C69.1 C70.1 C71.1 C72.1 C73.1 C74.1 C75.1 C76.1 C77.1 C78.1 C79.1 EEPROM1.8(VCC) R44.1 R46.2 R48.2 R50.1 R51.1 R52.1 R54.2 R56.2 R58.1 R61.2 R62.2 R63.1 R64.1 U5.3(VDDA3V3) U5.17(VDDIO) U6.3(VDDA3V3) U6.17(VDDIO)
ECAT0_INT_GPIO154: R50.2 U5.21(PWRDN/INT)
ECAT0_LINK_GPIO143: R59.2
ECAT0_PHYLINK_GPIO148: U5.31(CLKOUT/LED1/Strap1)
ECAT0_RXCLK_GPIO163: U5.19(RX_CLK/50MHz_RMII)
ECAT0_RXD0_GPIO165: U5.16(Strap0/RX_D0)
ECAT0_RXD1_GPIO166: U5.15(Strap9/RX_D1)
ECAT0_RXD2_GPIO167: U5.14(Strap8/RX_D2)
ECAT0_RXD3_GPIO168: R46.1 U5.13(Strap7/RX_D3)
ECAT0_RXDV_GPIO162: U5.18(RX_DV/CRS_DV/Strap10)
ECAT0_RXERR_GPIO164: R44.2 U5.20(RX_ER/Strap6)
ECAT0_TXCLK_GPIO157: U5.22(TX_CLK/Strap5)
ECAT0_TXD0_GPIO158: U5.24(TX_D0)
ECAT0_TXD1_GPIO159: U5.25(TX_D1)
ECAT0_TXD2_GPIO160: U5.26(TX_D2)
ECAT0_TXD3_GPIO161: U5.27(TX_D3)
ECAT0_TXEN_GPIO156: U5.23(TX_EN)
ECAT1_INT_GPIO128: R58.2 U6.21(PWRDN/INT)
ECAT1_LINK_GPIO144: R60.2
ECAT1_PHYLINK_GPIO68: U6.31(CLKOUT/LED1/Strap1)
ECAT1_RXCLK_GPIO137: U6.19(RX_CLK/50MHz_RMII)
ECAT1_RXD0_GPIO139: U6.16(Strap0/RX_D0)
ECAT1_RXD1_GPIO140: U6.15(Strap9/RX_D1)
ECAT1_RXD2_GPIO141: U6.14(Strap8/RX_D2)
ECAT1_RXD3_GPIO142: R54.1 U6.13(Strap7/RX_D3)
ECAT1_RXDV_GPIO136: U6.18(RX_DV/CRS_DV/Strap10)
ECAT1_RXER_GPIO138: R52.2 U6.20(RX_ER/Strap6)
ECAT1_TXCLK_GPIO130: U6.22(TX_CLK/Strap5)
ECAT1_TXD0_GPIO131: U6.24(TX_D0)
ECAT1_TXD1_GPIO132: U6.25(TX_D1)
ECAT1_TXD2_GPIO134: U6.26(TX_D2)
ECAT1_TXD3_GPIO135: U6.27(TX_D3)
ECAT1_TXEN_GPIO129: U6.23(TX_EN)
ECAT_EEPROM_SCL_GPIO151: EEPROM1.6(SCL) R62.1
ECAT_EEPROM_SDA_GPIO150: EEPROM1.5(SDA) R61.1
ECAT_ERROR_GPIO145: D5.K
ECAT_MDC_GPIO152: U5.12(MDC) U6.12(MDC)
ECAT_MDIO_GPIO153: R48.1 R56.1 U5.11(MDIO) U6.11(MDIO)
ECAT_nRST_GPIO155: U5.32(RST_N) U6.32(RST_N)
ECAT_RUN_GPIO146: D6.K
P0_25MHZ_CLK: U5.9(XI)
P0_RD_N: T2.1 U5.4(RD_M)
P0_RD_P: T2.2 U5.5(RD_P)
P0_RX_N: J13.4 L2.3
P0_RX_P: J13.3 L2.2
P0_RX_TF_N: L2.4 T2.6
P0_RX_TF_P: L2.1 T2.7
P0_TD_N: T1.1 U5.6(TD_M)
P0_TD_P: T1.2 U5.7(TD_P)
P0_TX_N: J13.2 L1.3
P0_TX_P: J13.1 L1.2
P0_TX_TF_N: L1.4 T1.6
P0_TX_TF_P: L1.1 T1.7
P1_25MHZ_CLK: U6.9(XI)
P1_RD_N: T4.1 U6.4(RD_M)
P1_RD_P: T4.2 U6.5(RD_P)
P1_RX_N: J14.4 L4.3
P1_RX_P: J14.3 L4.2
P1_RX_TF_N: L4.4 T4.6
P1_RX_TF_P: L4.1 T4.7
P1_TD_N: T3.1 U6.6(TD_M)
P1_TD_P: T3.2 U6.7(TD_P)
P1_TX_N: J14.2 L3.3
P1_TX_P: J14.1 L3.2
P1_TX_TF_N: L3.4 T3.6
P1_TX_TF_P: L3.1 T3.7
Strap2_0: R43.2 U5.30(LED0/Strap2)
Strap2_1: R51.2 U6.30(LED0/Strap2)
NetC52_2: C52.2 T1.5
NetC53_2: C53.2 T2.5
NetC54_1: C54.1 U5.2(CEXT)
NetC55_1: C55.1 R45.1 R47.1
NetC58_2: C58.2 T3.5
NetC59_2: C59.2 T4.5
NetC60_1: C60.1 U6.2(CEXT)
NetC61_1: C61.1 R53.1 R55.1
NetD3_A: D3.A R59.1
NetD4_A: D4.A R60.1
NetD5_A: D5.A R63.2
NetD6_A: D6.A R64.2
NetR45_2: R45.2 T1.3 T1.4
NetR47_2: R47.2 T2.3 T2.4
NetR49_1: R49.1 U5.10(RBIAS)
NetR53_2: R53.2 T3.3 T3.4
NetR55_2: R55.2 T4.3 T4.4
NetR57_1: R57.1 U6.10(RBIAS)

Not connected (* = marked no-connect by the designer): U5 1(ModeSelect)* 8(XO)* 28(COL/LED2/GPIO/Strap4)* 29(CRS/LED3/Strap3)*; U6 1(ModeSelect)* 8(XO)* 28(COL/LED2/GPIO/Strap4)* 29(CRS/LED3/Strap3)*

### Layout directives
differential pair; differential pair class EtherCAT: P0_RD_N, P0_RD_P, P0_RX_N, P0_RX_P, P0_RX_TF_N, P0_RX_TF_P, P0_TD_N, P0_TX_N, P0_TX_P, P0_TX_TF_N, P0_TX_TF_P, P1_RD_N, P1_RD_P, P1_RX_N, P1_RX_P, P1_RX_TF_N, P1_RX_TF_P, P1_TD_N, P1_TD_P, P1_TX_N, P1_TX_P, P1_TX_TF_N, P1_TX_TF_P
differential pair; differential pair class EtherCAT; differential pair class EtherCAT: P0_TD_P

### Notes on the sheet
- (near U5) EtherCAT P0
- (near T1) EtherCAT Magnetics
- (near J13) IN
- (near U5) Strap2=0->PHY_ADDR0=0
  Strap6=1->Pin31=LED1=PhyLinkStatus
  Strap7=1->Fast drop link enable
- (near U6) EtherCAT P1
- (near T3) EtherCAT Magnetics
- (near J14) OUT
- (near U6) Strap2=1->PHY_ADDR0=1
  Strap6=1->Pin31=LED1=PhyLinkStatus
  Strap7=1->Fast drop link enable
- Decoupling capacitors, place close to P0
- Decoupling capacitors, place close to P1
- LINK0/ACT
- LINK1/ACT
- ERROR
- Title:
- RUN
- Date:
- Project:
- Author:
- Rev:
- Size:
- A3
- File:
- Sheet
- of
- (in symbol 74930000) N3; N4; N1; N2

### Library data of the parts
C52 C53 C58 C59 = 100nF/16V 0402 10% X7R: 100nF/16V 0402 10% Tolerance X7R Multilayer Ceramic Chip Capacitor; Manufacturer 1: SAMSUNG; Manufacturer Part Number 1: CL05B104KO5VPNC; Supplier Part Number 1: 3013350; Supplier 1: Farnell
C54 C60 C63 C65 C69 C73 C77 = 100nF/10V 0402 20% X5R: as C96 on sheet MC21R01_uC_ADC; Supplier Part Number 1: 2810260; Supplier 1: Farnell
C55 C61 = 1000pF/2KV 1206 10% X7R: 1000 pF 2 KV 1206  ±10% Tolerance X7R Multilayer Ceramic Chip Capacitor; Manufacturer 1: Kemet; Manufacturer Part Number 1: C1206C102KGRACTU; Supplier Part Number 1: 1572651; Supplier 1: Farnell; Value: 1000pF/2KV
C56 C62 = 2200pF/100V 0402 10% X7S: 2200pF/100V 0402 10% Tolerance X7S Multilayer Ceramic Chip Capacitor; Manufacturer 1: TDK; Manufacturer Part Number 1: C1005X7S2A222K050BB; Supplier 1: Farnell; Supplier Part Number 1: 2906779
C64 C68 C72 C76 = 10nF/10V 0402 20% X5R: as C196 on sheet MC21R01_uC_ADC; Supplier Part Number 1: 2773069; Supplier 1: Farnell
C66 C70 C74 C78 = 1uF/6.3V 0402 10% X5R: as C97 on sheet MC21R01_uC_ADC; Supplier Part Number 1: 1288253; Supplier 1: Farnell
C67 C71 C75 C79 = 10uF/6.3V 0402 20% X5R: 10uF/6.3V 0402 20% Tolerance X5R Multilayer Ceramic Chip Capacitor; Manufacturer 1: KEMET; Manufacturer Part Number 1: C0402C106M9PACTU; Supplier Part Number 1: 2507061; Supplier 1: Farnell
D3 D4 D6 = LED_0402_green: Low Profile Chip LED, Green; Manufacturer: ROHM; Manufacturer Part Number: SML-P11MTT86R; Supplier 1: Farnell; Supplier Part Number 1: 2507544
D5 = LED_0402_Red: Low Profile Chip LED, Red; Manufacturer: ROHM; Manufacturer Part Number: SML-P11UTT86R; Supplier 1: Farnell; Supplier Part Number 1: 2507545
EEPROM1 = CAT24C16HU4I-GT3: CAT24C16 Series 16 Kb (2K x 8) 400 kHz I2C CMOS Serial EEPROM - UDFN-8EP; Manufacturer: ON Semi; Manufacturer Part Number: CAT24C16 Series 16 Kb (2K x 8) 400 kHz I2C CMOS Serial EEPROM - UDFN-8EP; Created By: AMP; Published: 20-08-2020; Supplier 1: Mouser; Supplier Part Number 1: 863-CAT24C16HU4I-GT3
J13 J14 = Molex 5055680581: 1.25mm Pitch, Micro-Lock Plus PCB Header, Single Row, Vertical, Surface Mount, Gold Plating, Positive Lock, 5 Circuits, Tape and Reel, Black; Mating Part Number: Molex 5055650501; Crimp: Molex 5054311100; Created by: AMP; Published: 29/05/2020; Manufacturer: Molex; Manufacturer Part Number: 5055680581; Supplier 1: Mouser; Supplier Part Number 1: 538-505568-0581
L1-L4 = 744232222: WE-CNSW SMT Common Mode Line Filter, size 1206, 2200Ohm, 0.2A, 50V; Manufacturer: Wurth Elektronik; DC Resistance max.: 1.2Ohm; Impedance Test Condition: 100MHz; Insulation Test Voltage: 125VAC; Winding Style: bifiliar; ComponentLink1Description: Manufacturer; ComponentLink1URL: http://www.we-online.de; ComponentLink2Description: Datasheet; ComponentLink2URL: https://www.we-online.com/catalog/datasheet/744232222.pdf; Operating Temperature: -40 to +125degC; Packaging: Tape and Reel; Published Date: April 2020; Rated Current: 0.2A; Size: 1206; Impedance: 2200Ohm; Manufacturer Part Number: 744232222; Rated Voltage: 50V; Mounting Technology: SMT; Supplier 1: Mouser; Supplier Part Number 1: 710-744232222
R43 R44 R46 R51 R52 R54 = 2.49K/50V 1% 0402 100mW: 2.49K/50V 1% 0402 100mW SMD Resistor; Manufacturer 1: Vishay; Manufacturer Part Number 1: CRCW04022K49FKED; Supplier 1: Farnell; Supplier Part Number 1: 1469690; Value: 2.49K
R45 R47 R53 R55 = 75R/50V 1% 0402 100mW: 75R/50V 1% 0402 100mW SMD Resistor; Manufacturer 1: Vishay; Manufacturer Part Number 1: RC0402FR-071KL; Supplier 1: Farnell; Supplier Part Number 1: 1469734; Value: 75R
R48 R56 R59 R60 R63 R64 = 2K2/50V 1% 0402 100mW: 2K2/50V 1% 0402 100mW SMD Resistor; Manufacturer 1: Yageo; Manufacturer Part Number 1: RC0402FR-072K2L; Value: 2.2k; Supplier 1: Farnell; Supplier Part Number 1: 9239278
R49 R57 = 6.49K/50V 1% 0402 100mW: 6.49K/50V 1% 0402 100mW SMD Resistor; Manufacturer 1: Vishay; Manufacturer Part Number 1: CRCW04026K49FKED; Supplier 1: Farnell; Supplier Part Number 1: 1469727; Value: 6.49K
R50 R58 = 10K/50V 1% 0402 100mW: 10K/50V 1% 0402 100mW SMD Resistor; Manufacturer 1: Yageo; Manufacturer Part Number 1: RC0402FR-0710KL; Supplier 1: Farnell; Supplier Part Number 1: 9239359; Value: 10K
R61 R62 = 4.7K/50V 1% 0402 100mW: 4.7K/50V 1% 0402 100mW SMD Resistor; Manufacturer 1: Vishay; Manufacturer Part Number 1: CRCW04024K70FKED; Supplier 1: Farnell; Supplier Part Number 1: 1469712; Value: 4.7K
T1-T4 = 74930000: WE-STST Super Tiny Signal Transformer, size 4532, 350uH; Insulation Test Voltage: 1500VRMS; Turns Ratio: 1:1; ComponentLink1Description: Manufacturer; ComponentLink1URL: http://www.we-online.de; ComponentLink2Description: Datasheet; ComponentLink2URL: https://katalog.we-online.com/pbs/datasheet/74930000.pdf; Packaging: Tape and Reel; Publisher: Wurth Elektronik; Size: 4532; Inductance: 350uH; Mounting Technology: SMT; Operating Temperature: -40 to +105degC; Part Number: 74930000; Published Date: November 2019
U5 U6 = DP83826IRHBR: Low latency 10/100-Mbps PHY, MII interface and enhanced mode with an industrial temperature range 32-VQFN -40 to 85; Manufacturer: Texas Instruments; Supplier 1: Avnet; Manufacturer Part Number: DP83826IRHBR; Pricing 1: 3000=1,00750, 6000=0,96850, 12000=0,92300, 18000=0,89700, 24000=0,86450 (USD); ComponentLink1URL: https://octopart.com/click/track?ai=8629&ct=datasheets&sig=00cfb32&at=physicalpart&sid=370&ppid=108112645&hlid=29178382&src-supplier=TI+store; ComponentLink1Description: https://octopart.com/click/track?ai=8629&ct=datasheets&sig=00cfb32&at=physicalpart&sid=370&ppid=108112645&hlid=29178382&src-supplier=TI+store; Supplier Part Number 1: DP83826IRHBR

## Sheet MC21R01_BoardtoBoard_connectors.SchDoc: MC21R01 Top Level
size A3; Author: AMP; DrawnBy: AMP; Organization: Altium Limited; Address1: 3 Minna Close; Address2: Belrose; Address3: NSW 2085; Address4: Australia; DocumentNumber: 0; Revision: 1.0; SheetNumber: 0; SheetTotal: 0
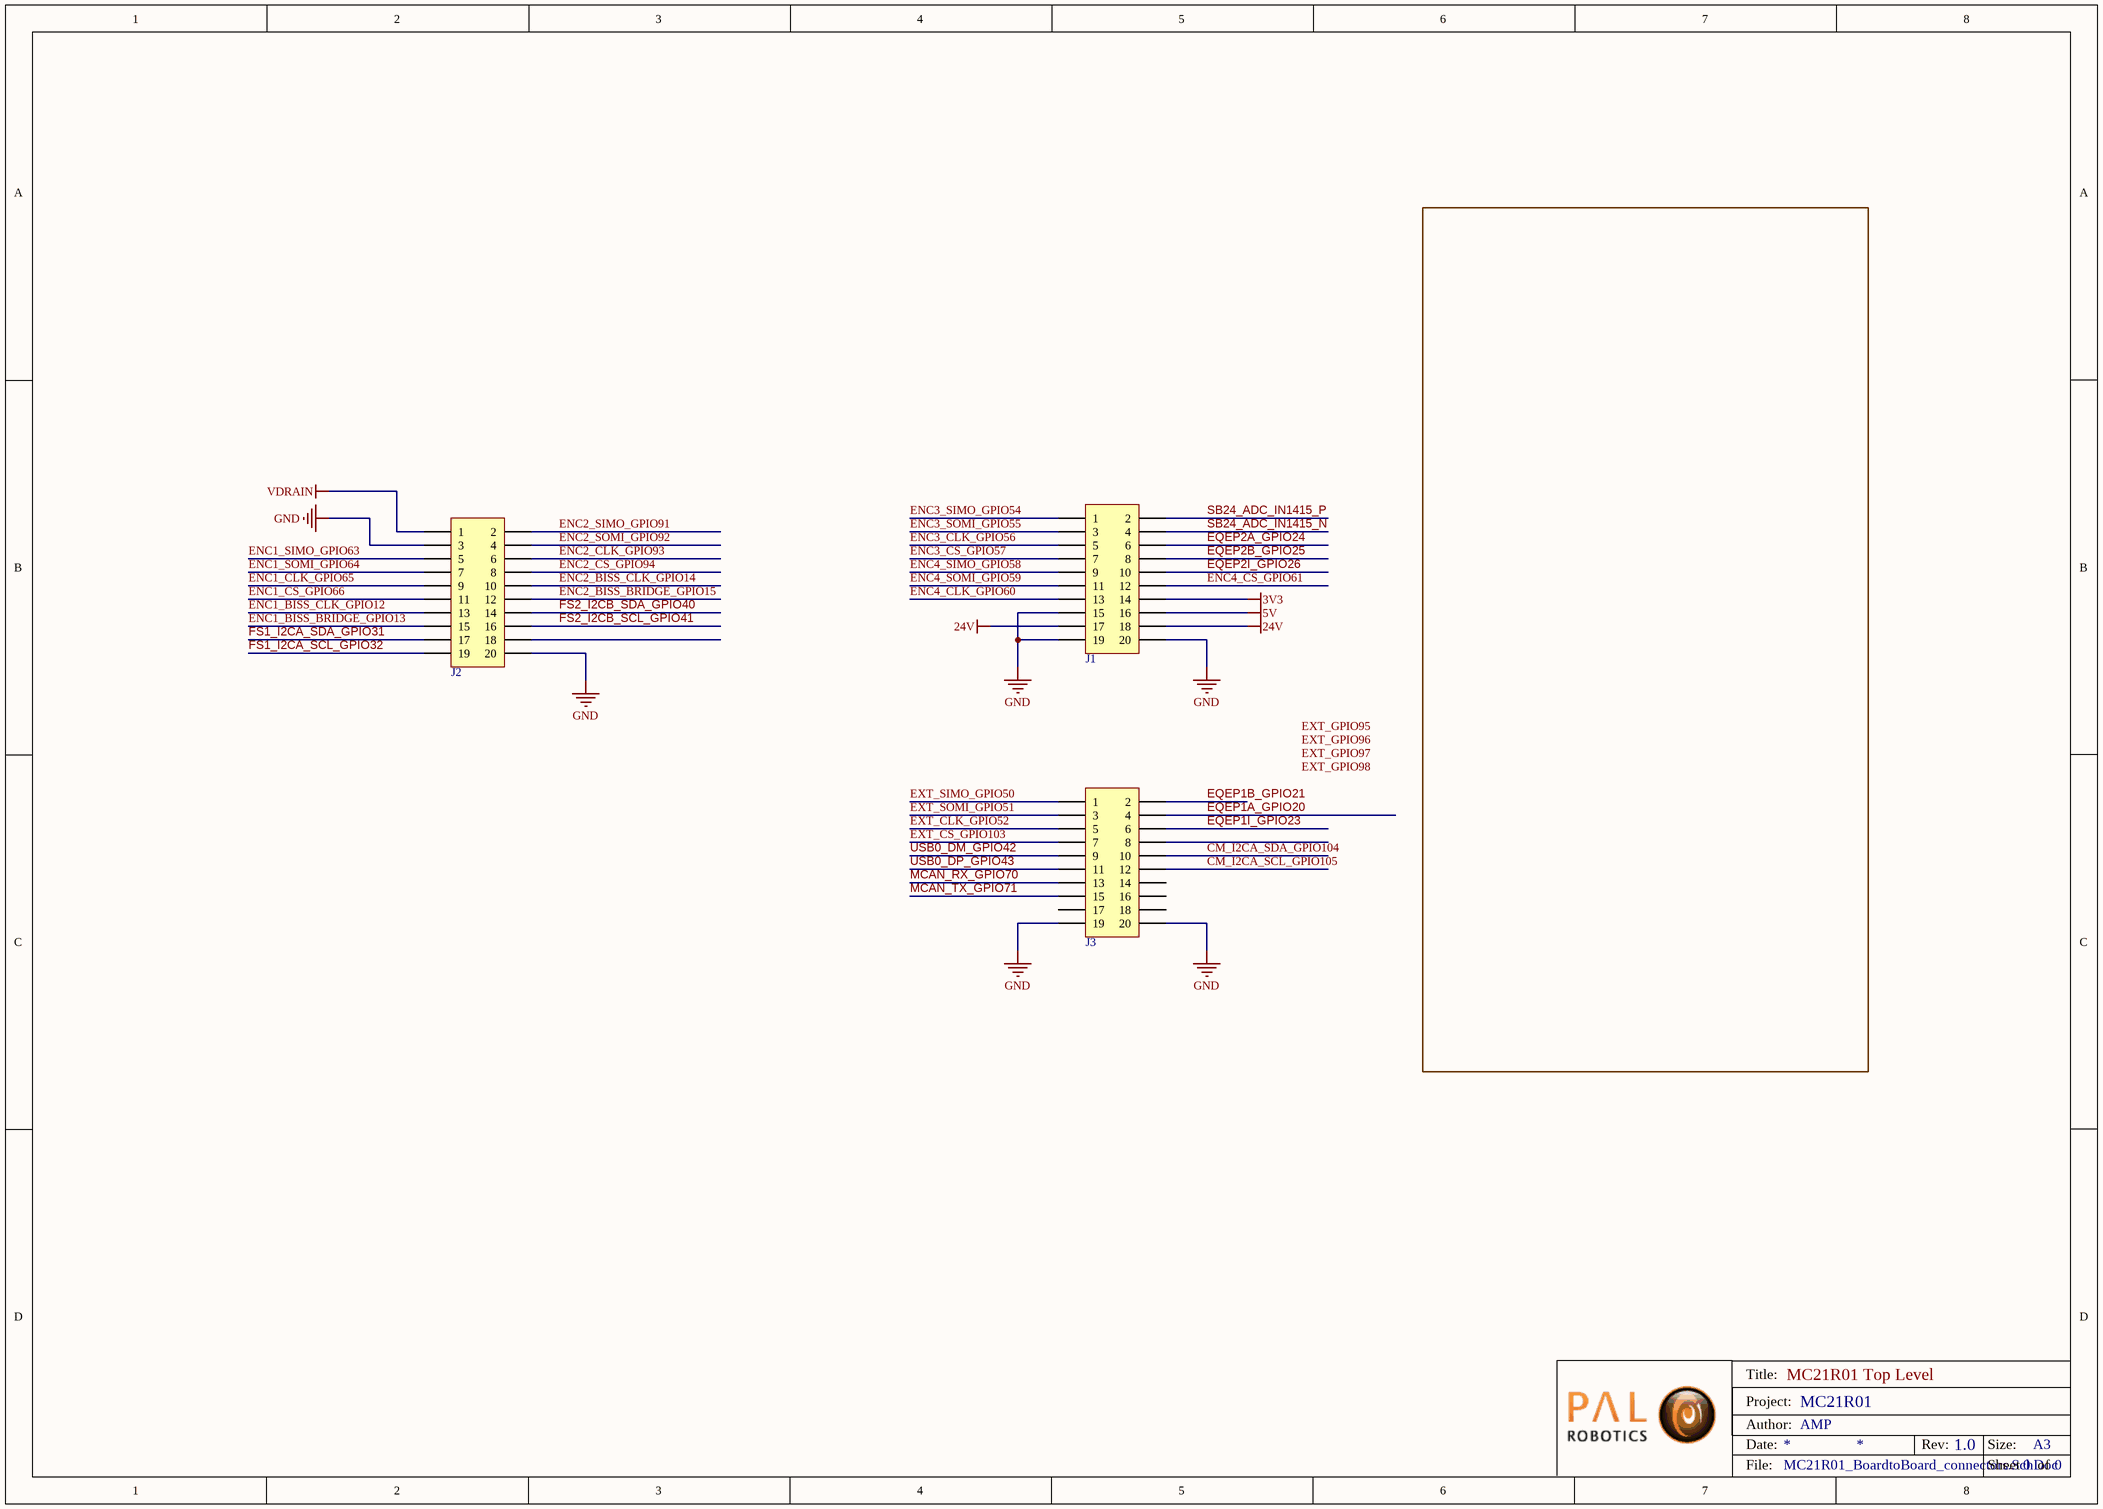
[diagram p10: MC21R01_BoardtoBoard_connectors.SchDoc]

### Parts
J1  Amphenol 20021321-00020C4LF  [Amphenol 20021321-10020C4LF]  (value not drawn)
J2  Amphenol 20021321-00020C4LF  [Amphenol 20021321-10020C4LF]  (value not drawn)
J3  Amphenol 20021321-00020C4LF  [Amphenol 20021321-10020C4LF]  (value not drawn)

### Nets
3V3: J1.14
5V: J1.16
24V: J1.17 J1.18
GND: J1.15 J1.19 J1.20 J2.3 J2.20 J3.19 J3.20
VDRAIN: J2.1
CM_I2CA_SCL_GPIO105: J3.12
CM_I2CA_SDA_GPIO104: J3.10
ENC1_BISS_BRIDGE_GPIO13: J2.15
ENC1_BISS_CLK_GPIO12: J2.13
ENC1_CLK_GPIO65: J2.9
ENC1_CS_GPIO66: J2.11
ENC1_SIMO_GPIO63: J2.5
ENC1_SOMI_GPIO64: J2.7
ENC2_BISS_BRIDGE_GPIO15: J2.12
ENC2_BISS_CLK_GPIO14: J2.10
ENC2_CLK_GPIO93: J2.6
ENC2_CS_GPIO94: J2.8
ENC2_SIMO_GPIO91: J2.2
ENC2_SOMI_GPIO92: J2.4
ENC3_CLK_GPIO56: J1.5
ENC3_CS_GPIO57: J1.7
ENC3_SIMO_GPIO54: J1.1
ENC3_SOMI_GPIO55: J1.3
ENC4_CLK_GPIO60: J1.13
ENC4_CS_GPIO61: J1.12
ENC4_SIMO_GPIO58: J1.9
ENC4_SOMI_GPIO59: J1.11
EQEP1A_GPIO20: J3.4
EQEP1B_GPIO21: J3.2
EQEP1I_GPIO23: J3.6
EQEP2A_GPIO24: J1.6
EQEP2B_GPIO25: J1.8
EQEP2I_GPIO26: J1.10
EXT_CLK_GPIO52: J3.5
EXT_CS_GPIO103: J3.7
EXT_SIMO_GPIO50: J3.1
EXT_SOMI_GPIO51: J3.3
FS1_I2CA_SCL_GPIO32: J2.19
FS1_I2CA_SDA_GPIO31: J2.17
FS2_I2CB_SCL_GPIO41: J2.16
FS2_I2CB_SDA_GPIO40: J2.14
MCAN_RX_GPIO70: J3.13
MCAN_TX_GPIO71: J3.15
SB24_ADC_IN1415_N: J1.4
SB24_ADC_IN1415_P: J1.2
USB0_DM_GPIO42: J3.9
USB0_DP_GPIO43: J3.11

Not connected (* = marked no-connect by the designer): J2 18; J3 8 14 16 17 18

### Notes on the sheet
- Title:
- Date:
- Project:
- Author:
- Rev:
- Size:
- A3
- File:
- Sheet
- of
- Labels drawn without touching a wire or pin: EXT_GPIO95, EXT_GPIO96, EXT_GPIO97, EXT_GPIO98

### Library data of the parts
J1-J3 = Amphenol 20021321-00020C4LF: Receptacle, Minitek127®, Board to Board connectors, PCB mounted Receptacle, Vertical, Surface Mount, Double Row, 20 Positions, 1.27mm (0.05inch) pitch; Manufacturer: Amphenol; Manufacturer Part Number: 20021321-00020C4LF; Supplier 1: Farnell; Supplier Part Number 1: 1865312